# Altium project AIO_3399J_Schematic.PrjPcb (part 3 of 5)

## Sheet HOST_PORT-USB2.0.SchDoc
size C
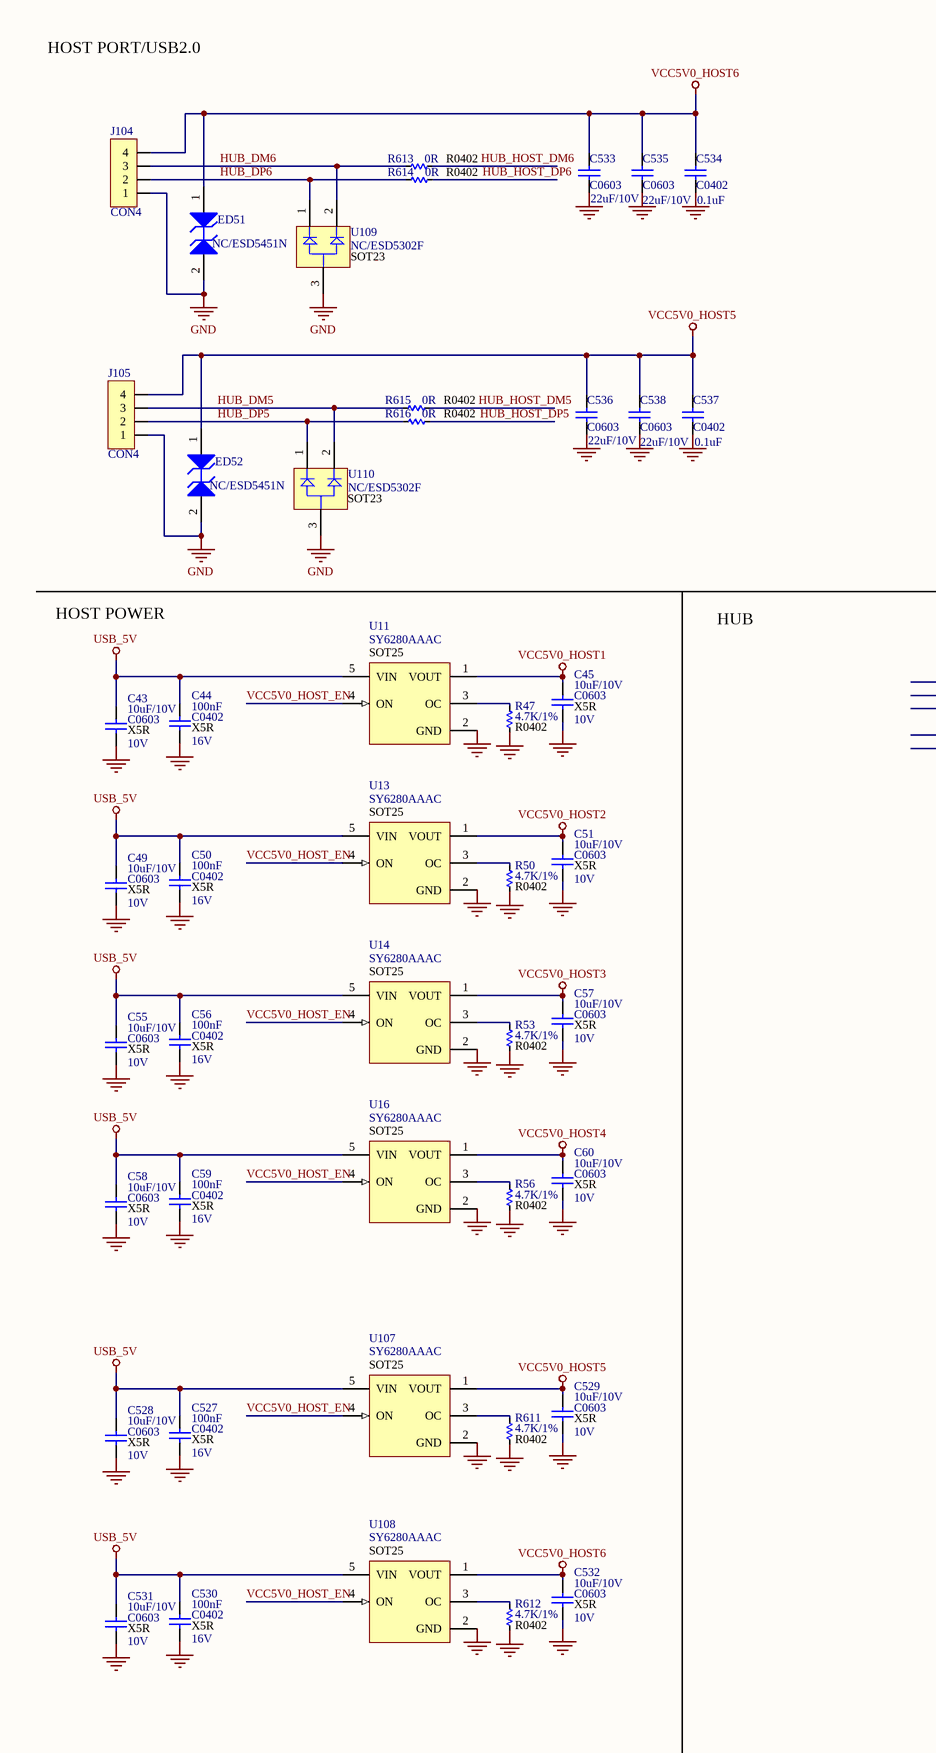
[diagram p9: HOST_PORT-USB2.0.SchDoc, left]
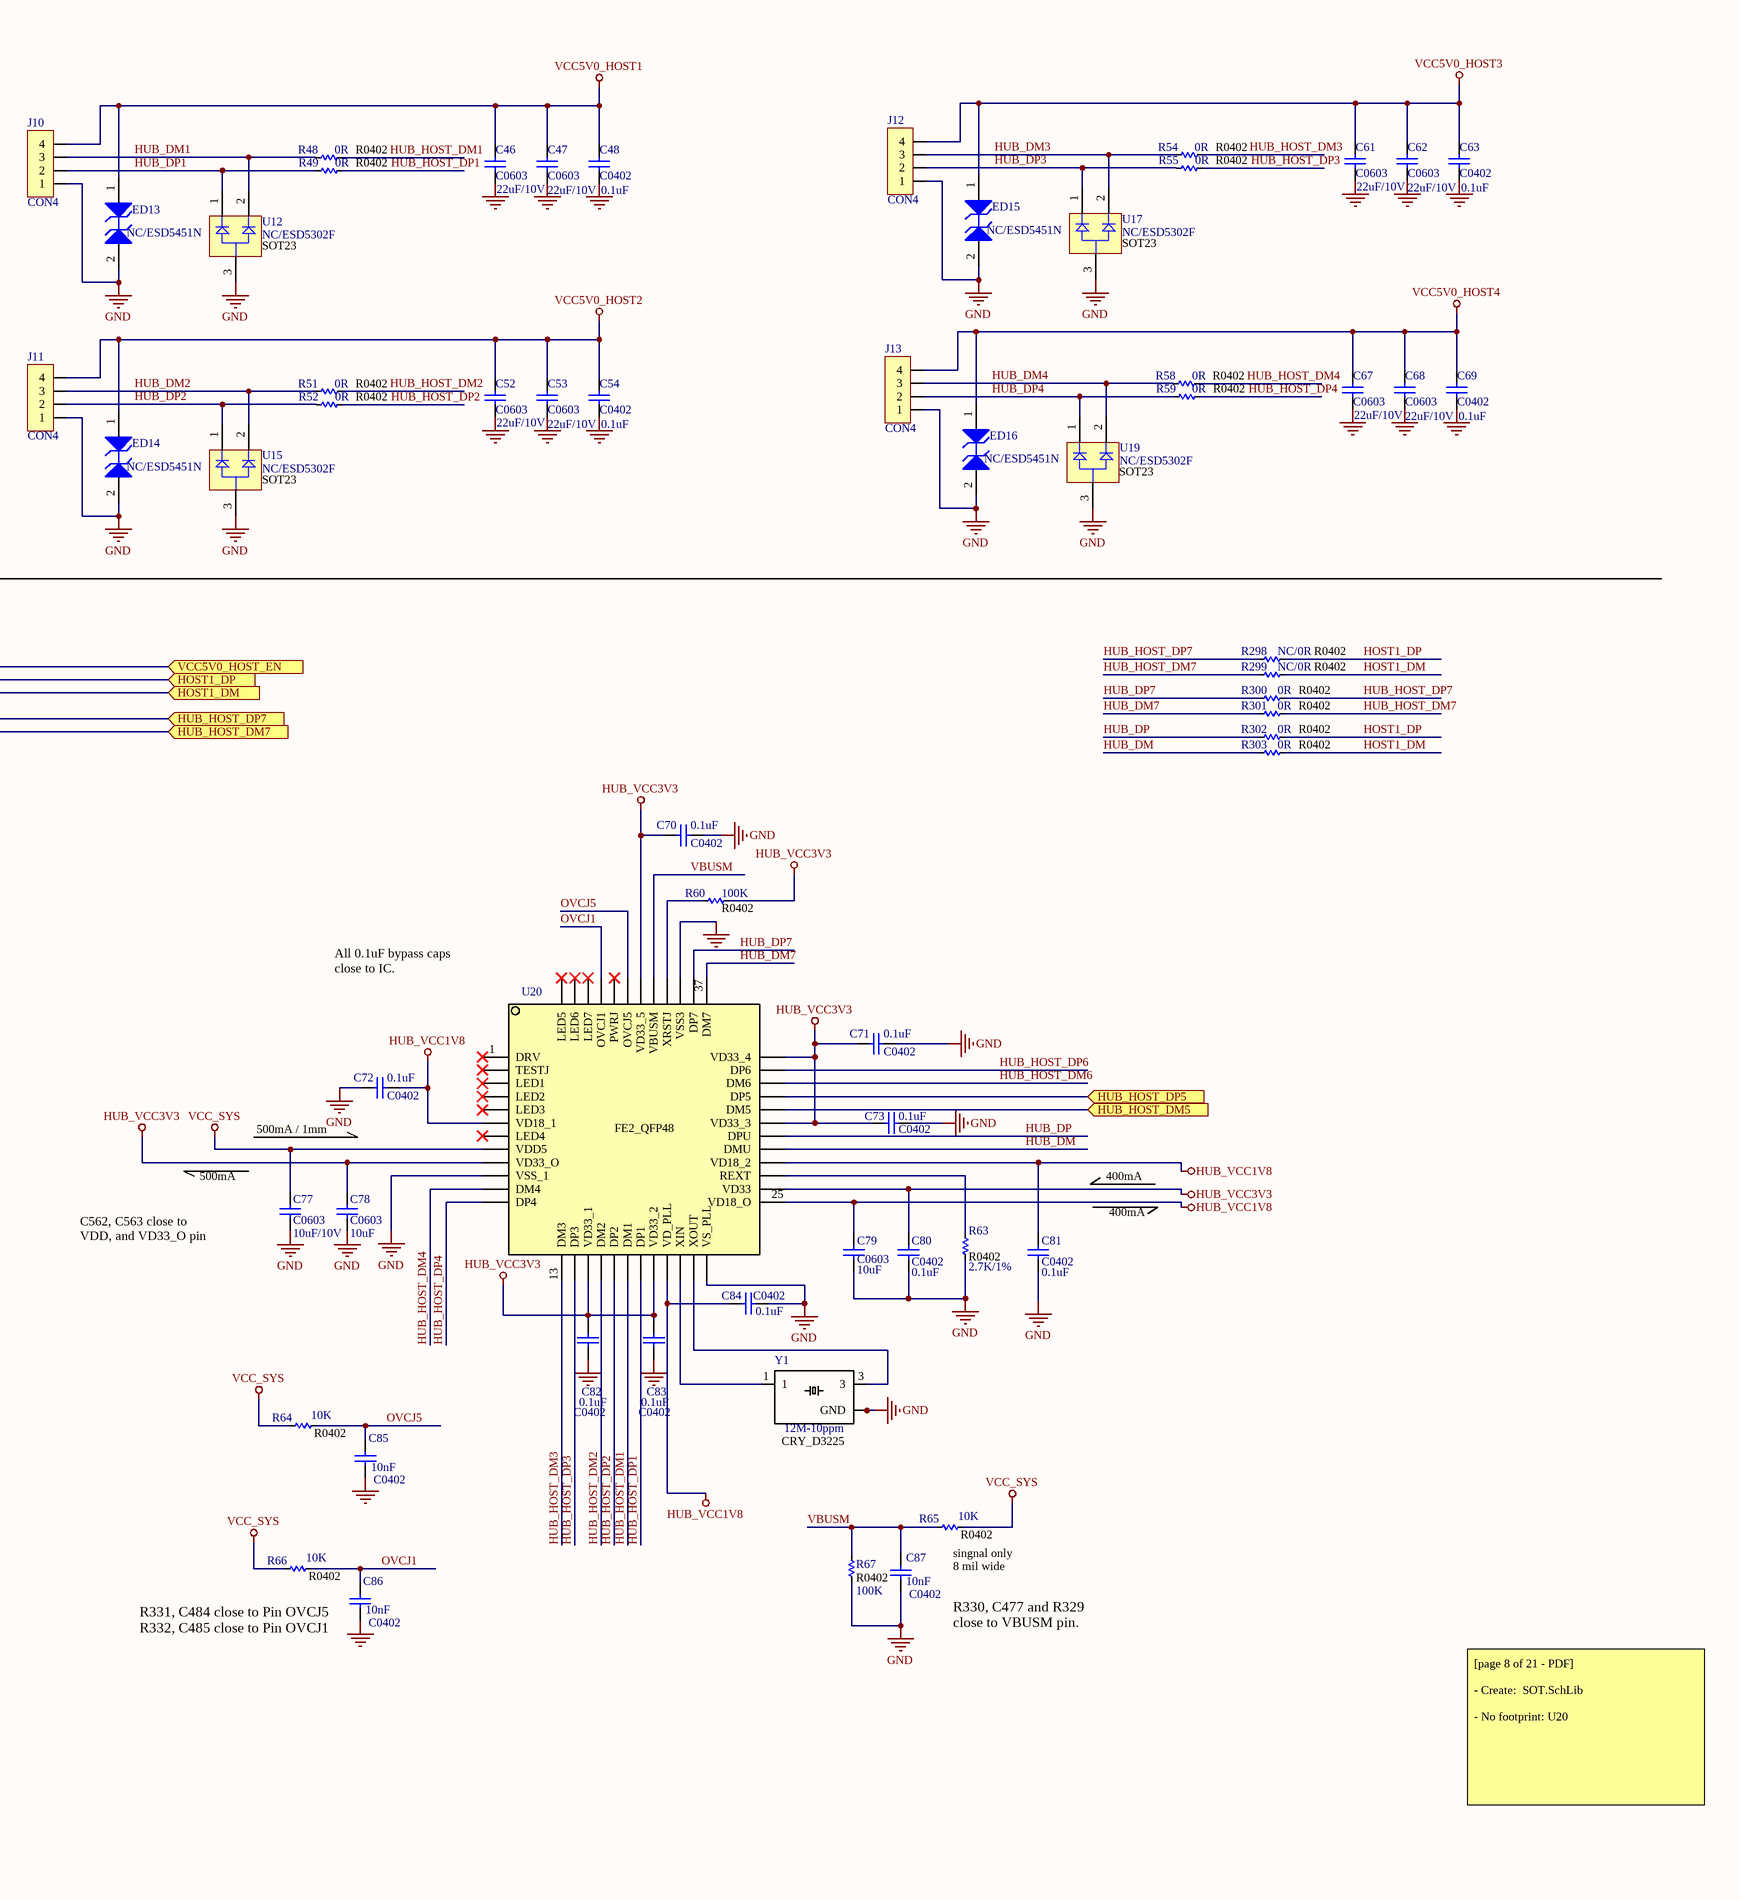
[diagram p10: HOST_PORT-USB2.0.SchDoc, right]

### Parts
C43  C0603  value 10uF/10V  [C 0603]
C44  C0402  value 100nF  [C 0402]
C45  C0603  value 10uF/10V  [C 0603]
C46  C0603  value 22uF/10V  [C 0603]
C47  C0603  value 22uF/10V  [C 0603]
C48  C0402  value 0.1uF  [C 0402]
C49  C0603  value 10uF/10V  [C 0603]
C50  C0402  value 100nF  [C 0402]
C51  C0603  value 10uF/10V  [C 0603]
C52  C0603  value 22uF/10V  [C 0603]
C53  C0603  value 22uF/10V  [C 0603]
C54  C0402  value 0.1uF  [C 0402]
C55  C0603  value 10uF/10V  [C 0603]
C56  C0402  value 100nF  [C 0402]
C57  C0603  value 10uF/10V  [C 0603]
C58  C0603  value 10uF/10V  [C 0603]
C59  C0402  value 100nF  [C 0402]
C60  C0603  value 10uF/10V  [C 0603]
C61  C0603  value 22uF/10V  [C 0603]
C62  C0603  value 22uF/10V  [C 0603]
C63  C0402  value 0.1uF  [C 0402]
C67  C0603  value 22uF/10V  [C 0603]
C68  C0603  value 22uF/10V  [C 0603]
C69  C0402  value 0.1uF  [C 0402]
C70  C0402  value 0.1uF  [C 0402]
C71  C0402  value 0.1uF  [C 0402]
C72  C0402  value 0.1uF  [C 0402]
C73  C0402  value 0.1uF  [C 0402]
C77  C0603  value 10uF/10V  [C 0603]
C78  C0603  value 10uF  [C 0603]
C79  C0603  value 10uF  [C 0603]
C80  C0402  value 0.1uF  [C 0402]
C81  C0402  value 0.1uF  [C 0402]
C82  C0402  value 0.1uF  [C 0402]
C83  C0402  value 0.1uF  [C 0402]
C84  C0402  value 0.1uF  [C 0402]
C85  C0402  value 10nF  [C 0402]
C86  C0402  value 10nF  [C 0402]
C87  C0402  value 10nF  [C 0402]
C527  C0402  value 100nF  [C 0402]
C528  C0603  value 10uF/10V  [C 0603]
C529  C0603  value 10uF/10V  [C 0603]
C530  C0402  value 100nF  [C 0402]
C531  C0603  value 10uF/10V  [C 0603]
C532  C0603  value 10uF/10V  [C 0603]
C533  C0603  value 22uF/10V  [C 0603]
C534  C0402  value 0.1uF  [C 0402]
C535  C0603  value 22uF/10V  [C 0603]
C536  C0603  value 22uF/10V  [C 0603]
C537  C0402  value 0.1uF  [C 0402]
C538  C0603  value 22uF/10V  [C 0603]
ED13  NC/ESD5451N  [DFN1006-2L]
ED14  NC/ESD5451N  [DFN1006-2L]
ED15  NC/ESD5451N  [DFN1006-2L]
ED16  NC/ESD5451N  [DFN1006-2L]
ED51  NC/ESD5451N  [DFN1006-2L]
ED52  NC/ESD5451N  [DFN1006-2L]
J10  CON4  [CON4]
J11  CON4  [CON4]
J12  CON4  [CON4]
J13  CON4  [CON4]
J104  CON4  [CON4]
J105  CON4  [CON4]
R47  R0402  value 4.7K/1%  [R 0402]
R48  R0402  value 0R  [R 0402]
R49  R0402  value 0R  [R 0402]
R50  R0402  value 4.7K/1%  [R 0402]
R51  R0402  value 0R  [R 0402]
R52  R0402  value 0R  [R 0402]
R53  R0402  value 4.7K/1%  [R 0402]
R54  R0402  value 0R  [R 0402]
R55  R0402  value 0R  [R 0402]
R56  R0402  value 4.7K/1%  [R 0402]
R58  R0402  value 0R  [R 0402]
R59  R0402  value 0R  [R 0402]
R60  R0402  value 100K  [R 0402]
R63  R0402  value 2.7K/1%  [R 0402]
R64  R0402  value 10K  [R 0402]
R65  R0402  value 10K  [R 0402]
R66  R0402  value 10K  [R 0402]
R67  R0402  value 100K  [R 0402]
R298  R0402  value NC/0R  [R 0402]
R299  R0402  value NC/0R  [R 0402]
R300  R0402  value 0R  [R 0402]
R301  R0402  value 0R  [R 0402]
R302  R0402  value 0R  [R 0402]
R303  R0402  value 0R  [R 0402]
R611  R0402  value 4.7K/1%  [R 0402]
R612  R0402  value 4.7K/1%  [R 0402]
R613  R0402  value 0R  [R 0402]
R614  R0402  value 0R  [R 0402]
R615  R0402  value 0R  [R 0402]
R616  R0402  value 0R  [R 0402]
U11  SY6280AAAC  [DCK5_N]
U12  NC/ESD5302F  PackageReference: SOT23  [INF-SOT23_N]
U13  SY6280AAAC  [DCK5_N]
U14  SY6280AAAC  [DCK5_N]
U15  NC/ESD5302F  PackageReference: SOT23  [INF-SOT23_N]
U16  SY6280AAAC  [DCK5_N]
U17  NC/ESD5302F  PackageReference: SOT23  [INF-SOT23_N]
U19  NC/ESD5302F  PackageReference: SOT23  [INF-SOT23_N]
U20  FE2_QFP48  [LQFP48_N]  (value not drawn)
U107  SY6280AAAC  [DCK5_N]
U108  SY6280AAAC  [DCK5_N]
U109  NC/ESD5302F  PackageReference: SOT23  [INF-SOT23_N]
U110  NC/ESD5302F  PackageReference: SOT23  [INF-SOT23_N]
Y1  12M-10ppm  [Crystal 4-SMD 32x25]

### Ports
HOST1_DM (in), HOST1_DP (in), HUB_HOST_DM5 (in), HUB_HOST_DM7 (in), HUB_HOST_DP5 (in), HUB_HOST_DP7 (in), VCC5V0_HOST_EN (in)

### Nets
GND: C43.2 C44.2 C45.2 C46.1 C47.1 C48.1 C49.2 C50.2 C51.2 C52.1 C53.1 C54.1 C55.2 C56.2 C57.2 C58.2 C59.2 C60.2 C61.1 C62.1 C63.1 C67.1 C68.1 C69.1 C70.1 C71.1 C72.2 C73.1 C77.2 C78.2 C79.2 C80.2 C81.2 C82.1 C83.2 C84.2 C85.2 C86.2 C87.2 C527.2 C528.2 C529.2 C530.2 C531.2 C532.2 C533.1 C534.1 C535.1 C536.1 C537.1 C538.1 ED13.2(A2) ED14.2(A2) ED15.2(A2) ED16.2(A2) ED51.2(A2) ED52.2(A2) J10.1 J11.1 J12.1 J13.1 J104.1 J105.1 R47.2 R50.2 R53.2 R56.2 R63.2 R67.1 R611.2 R612.2 U11.2(GND) U12.3(A) U13.2(GND) U14.2(GND) U15.3(A) U16.2(GND) U17.3(A) U19.3(A) U20.10(VSS_1) U20.24(VS_PLL) U20.39(VSS3) U107.2(GND) U108.2(GND) U109.3(A) U110.3(A) Y1.2(GND) Y1.4(GND)
HUB_VCC1V8: C72.1 C79.1 C81.1 C84.1 U20.6(VD18_1) U20.21(VD_PLL) U20.25(VD18_O) U20.28(VD18_2)
HUB_VCC3V3: C70.2 C71.2 C73.2 C78.1 C80.1 C82.2 C83.1 R60.1 U20.9(VD33_O) U20.15(VD33_1) U20.20(VD33_2) U20.26(VD33) U20.31(VD33_3) U20.36(VD33_4) U20.42(VD33_5)
USB_5V: C43.1 C44.1 C49.1 C50.1 C55.1 C56.1 C58.1 C59.1 C527.1 C528.1 C530.1 C531.1 U11.5(VIN) U13.5(VIN) U14.5(VIN) U16.5(VIN) U107.5(VIN) U108.5(VIN)
VCC5V0_HOST1: C45.1 C46.2 C47.2 C48.2 ED13.1(A1) J10.4 U11.1(VOUT)
VCC5V0_HOST2: C51.1 C52.2 C53.2 C54.2 ED14.1(A1) J11.4 U13.1(VOUT)
VCC5V0_HOST3: C57.1 C61.2 C62.2 C63.2 ED15.1(A1) J12.4 U14.1(VOUT)
VCC5V0_HOST4: C60.1 C67.2 C68.2 C69.2 ED16.1(A1) J13.4 U16.1(VOUT)
VCC5V0_HOST5: C529.1 C536.2 C537.2 C538.2 ED52.1(A1) J105.4 U107.1(VOUT)
VCC5V0_HOST6: C532.1 C533.2 C534.2 C535.2 ED51.1(A1) J104.4 U108.1(VOUT)
VCC_SYS: C77.1 R64.1 R65.2 R66.1 U20.8(VDD5)
HOST1_DM: R299.1 R303.1
HOST1_DP: R298.1 R302.1
HUB_DM: R303.2 U20.29(DMU)
HUB_DM1: J10.3 R48.2 U12.2(K2)
HUB_DM2: J11.3 R51.2 U15.2(K2)
HUB_DM3: J12.3 R54.2 U17.2(K2)
HUB_DM4: J13.3 R58.2 U19.2(K2)
HUB_DM5: J105.3 R615.2 U110.2(K2)
HUB_DM6: J104.3 R613.2 U109.2(K2)
HUB_DM7: R301.2 U20.37(DM7)
HUB_DP: R302.2 U20.30(DPU)
HUB_DP1: J10.2 R49.2 U12.1(K1)
HUB_DP2: J11.2 R52.2 U15.1(K1)
HUB_DP3: J12.2 R55.2 U17.1(K1)
HUB_DP4: J13.2 R59.2 U19.1(K1)
HUB_DP5: J105.2 R616.2 U110.1(K1)
HUB_DP6: J104.2 R614.2 U109.1(K1)
HUB_DP7: R300.2 U20.38(DP7)
HUB_HOST_DM1: R48.1 U20.18(DM1)
HUB_HOST_DM2: R51.1 U20.16(DM2)
HUB_HOST_DM3: R54.1 U20.13(DM3)
HUB_HOST_DM4: R58.1 U20.11(DM4)
HUB_HOST_DM5: R615.1
HUB_HOST_DM6: R613.1 U20.34(DM6)
HUB_HOST_DM7: R299.2 R301.1
HUB_HOST_DP1: R49.1 U20.19(DP1)
HUB_HOST_DP2: R52.1 U20.17(DP2)
HUB_HOST_DP3: R55.1 U20.14(DP3)
HUB_HOST_DP4: R59.1 U20.12(DP4)
HUB_HOST_DP5: R616.1
HUB_HOST_DP6: R614.1 U20.35(DP6)
HUB_HOST_DP7: R298.2 R300.1
OVCJ1: C86.1 R66.2 U20.45(OVCJ1)
OVCJ5: C85.1 R64.2 U20.43(OVCJ5)
VBUSM: C87.1 R65.1 R67.2 U20.41(VBUSM)
VCC5V0_HOST_EN: U11.4(ON) U13.4(ON) U14.4(ON) U16.4(ON) U107.4(ON) U108.4(ON)
NetR47_1: R47.1 U11.3(OC)
NetR50_1: R50.1 U13.3(OC)
NetR53_1: R53.1 U14.3(OC)
NetR56_1: R56.1 U16.3(OC)
NetR60_2: R60.2 U20.40(XRSTJ)
NetR63_1: R63.1 U20.27(REXT)
NetR611_1: R611.1 U107.3(OC)
NetR612_1: R612.1 U108.3(OC)
NetU20_22: U20.22(XIN) Y1.1
NetU20_23: U20.23(XOUT) Y1.3
NetU20_32: U20.32(DM5) ; port HUB_HOST_DM5
NetU20_33: U20.33(DP5) ; port HUB_HOST_DP5

Not connected (* = marked no-connect by the designer): U20 1(DRV)* 2(TESTJ)* 3(LED1)* 4(LED2)* 5(LED3)* 7(LED4)* 44(PWRJ)* 46(LED7)* 47(LED6)* 48(LED5)*

### Notes on the sheet
- HOST PORT/USB2.0
- HOST POWER
- HUB
- All 0.1uF bypass caps close to IC.
- 500mA
- 500mA / 1mm
- 400mA
- C562, C563 close to VDD, and VD33_O pin
- (near R65) singnal only 8 mil wide
- R331, C484 close to Pin OVCJ5
  R332, C485 close to Pin OVCJ1
- R330, C477 and R329 close to VBUSM pin.
- [page 8 of 21 - PDF]
  - Create:  SOT.SchLib
  - No footprint: U20
- (in symbol ABM8-30.000MHZ-10-1-U-T) CRY_D3225
- (in symbol Cap) X5R; 16V; 10V
- (in symbol TPS22943DCKR) SOT25

### Library data of the parts
C43-C63 C67-C73 C77-C87 C527-C538 = Cap: Capacitor; Published: 8-Jun-2000; LatestRevisionDate: 17-Jul-2002; LatestRevisionNote: Re-released for DXP Platform.; PackageReference: RAD-0.3; Publisher: Altium Limited; PackageDescription: Radial Cap, Thru-Hole; 2 Leads; 0.3 in Pin Spacing
ED13-ED16 ED51 ED52 = 1SMB54CAT3: 600 W Peak Power Zener Transient Voltage Suppressor, Bidirectional, 2-Pin SMB, Tape and Reel; Manufacturer: On Semiconductor; IR Max (uA): 5; PPK Max (W): 600; V(BR) Typ (V): 63.16; DatasheetVersion: Rev. A; PackageVersion: Rev. A, 01/2000; PackageReference: SMB-2-403C-01; PackageDescription: 2-Pin Small Molded Package, J-Bend Lead, Body 4.315 x 3.555 mm; Supplier 1: Digi-Key; Supplier Part Number 1: 1SMB54CAT3-ND; Direction: Bidirectional; Packing: Tape and Reel; Mounting Technology: Surface Mount; PartNumber: 1SMB54CAT3; ComponentLink1Description: Manufacturer URL; ComponentLink1URL: http://www.onsemi.com/; ComponentLink2Description: Datasheet; ComponentLink2URL: http://www.onsemi.com/pub_link/Collateral/1SMB10CAT3-D.PDF; ComponentLink3Description: Package Specification; ComponentLink3URL: http://www.onsemi.com/pub_link/Collateral/1SMB10CAT3-D.PDF
J10-J13 J104 J105 = JP4: WR-PHD 2.54 mm Angled Socket Header; Manufacturer: W¨¹rth Elektronik eiSos GmbH; partNo: 613004143121; ComponentLink1 Description: Manufacturer; ComponentLink2 Description: Datasheet; NoPins: 04; Created Date: 29 March 2013; ComponentLink1URL: http://www.we-online.com; ComponentLink2URL: http://katalog.we-online.de/em/datasheet/6130xx143121.pdf; Created by: Karrer Zheng
R47-R56 R58-R60 R63-R67 R298-R303 R611-R616 = Res-SMD: Resistor; Manufacturer: Generic Components; Class: Passive; Published: 08/06/2000; Publisher: Altium Hobart Technology Centre
U11 U13 U14 U16 U107 U108 = TPS22943DCKR: Low-Input Voltage 40 mA Current Limited Load Switch, 400 mOhms rDS(On), -40 to 85 degC, 5-pin SC70 (DCK), Green (RoHS & no Sb/Br); Manufacturer: Texas Instruments; Adjustable Current Limit(Min)(A): 0.04; Enable/Shutdown: Active High; Iq(Typ)(uA): 40; Number of FETs: 1; rDS(on) per FET(Typ)(mOhms): 400; SubFamily: Current Limited Switch; Vin(Max)(V): 5.5; Vin(Min)(V): 1.62; DatasheetVersion: SLVS832C; PackageVersion: revG, Jan-2007; PackageReference: DCK5; PackageDescription: 5-Pin Plastic Small-Outline Package, 2 x 1.3 mm Body, 0.65 mm Pitch, 2.1 mm Lead Span; Supplier 1: Digi-Key; Supplier Part Number 1: 296-25316-2-ND; Supplier 2: Digi-Key; Supplier Part Number 2: 296-25316-1-ND; Supplier 3: Digi-Key; Supplier Part Number 3: 296-25316-6-ND; Supplier 4: Farnell; Supplier Part Number 4: 1782839; Supplier 5: Newark; Supplier Part Number 5: 51R1165; Supplier 6: Mouser; Supplier Part Number 6: 595-TPS22943DCKR; Eco-Plan: Green (RoHS & no Sb/Br); Mounting Technology: Surface Mount; Code_JEDEC: MO-203-AA; PartNumber: TPS22943DCKR; ComponentLink1Description: Datasheet; ComponentLink1URL: http://www.ti.com/general/docs/lit/getliterature.tsp?genericPartNumber=TPS22943&fileType=pdf
U12 U15 U17 U19 U109 U110 = BAT64-06: Silicon Schottky Diode, SOT23, Reel, Green; Manufacturer: Infineon; Configuration: Dual; CT (max): 6 pF; Green: TRUE; IF (max): 250 mA; VF (max): 750 mV; VR (max): 40 V; PackageVersion: Apr-08; PackageDescription: 3-Pin Small Outline Transistor Package, 1.3 x 2.9 mm Body, 0.95 mm Pitch; Supplier 1: Mouser; Supplier Part Number 1: N/A; Packing: Reel; Mounting Technology: Surface Mount; PartNumber: BAT64-06; ComponentLink1Description: Manufacturer URL; ComponentLink1URL: http://www.infineon.com/; ComponentLink2Description: Datasheet; ComponentLink2URL: http://www.infineon.com/dgdl/bat64series.pdf?folderId=db3a30431400ef68011425f1ca2505e3&fileId=db3a304314dca3890115191757980ead; ComponentLink3Description: Package Specification; ComponentLink3URL: http://www.infineon.com/dgdl/SOT23-Package_Overview.pdf?folderId=db3a30431936bc4b0119532290053c66&fileId=db3a30431936bc4b0119533468123c85
Y1 = ABM8-30.000MHZ-10-1-U-T: Ultra Miniature Crystal, SMD Ceramic, 30.000MHZ, 10pF, 10ppm@25C, 10ppm -10+60C,; MF: Abracon; SnapEDA_Link: https://www.snapeda.com/parts/ABM8-30.000MHZ-10-1-U-T/Abracon%20LLC/view-part/?ref=snap; MP: ABM8-30.000MHZ-10-1-U-T; Availability: Unavailable; Price: None; Package: SMD-4 Abracon; Value: *

## Sheet TYPE_CO-USB3.0.SchDoc
size B
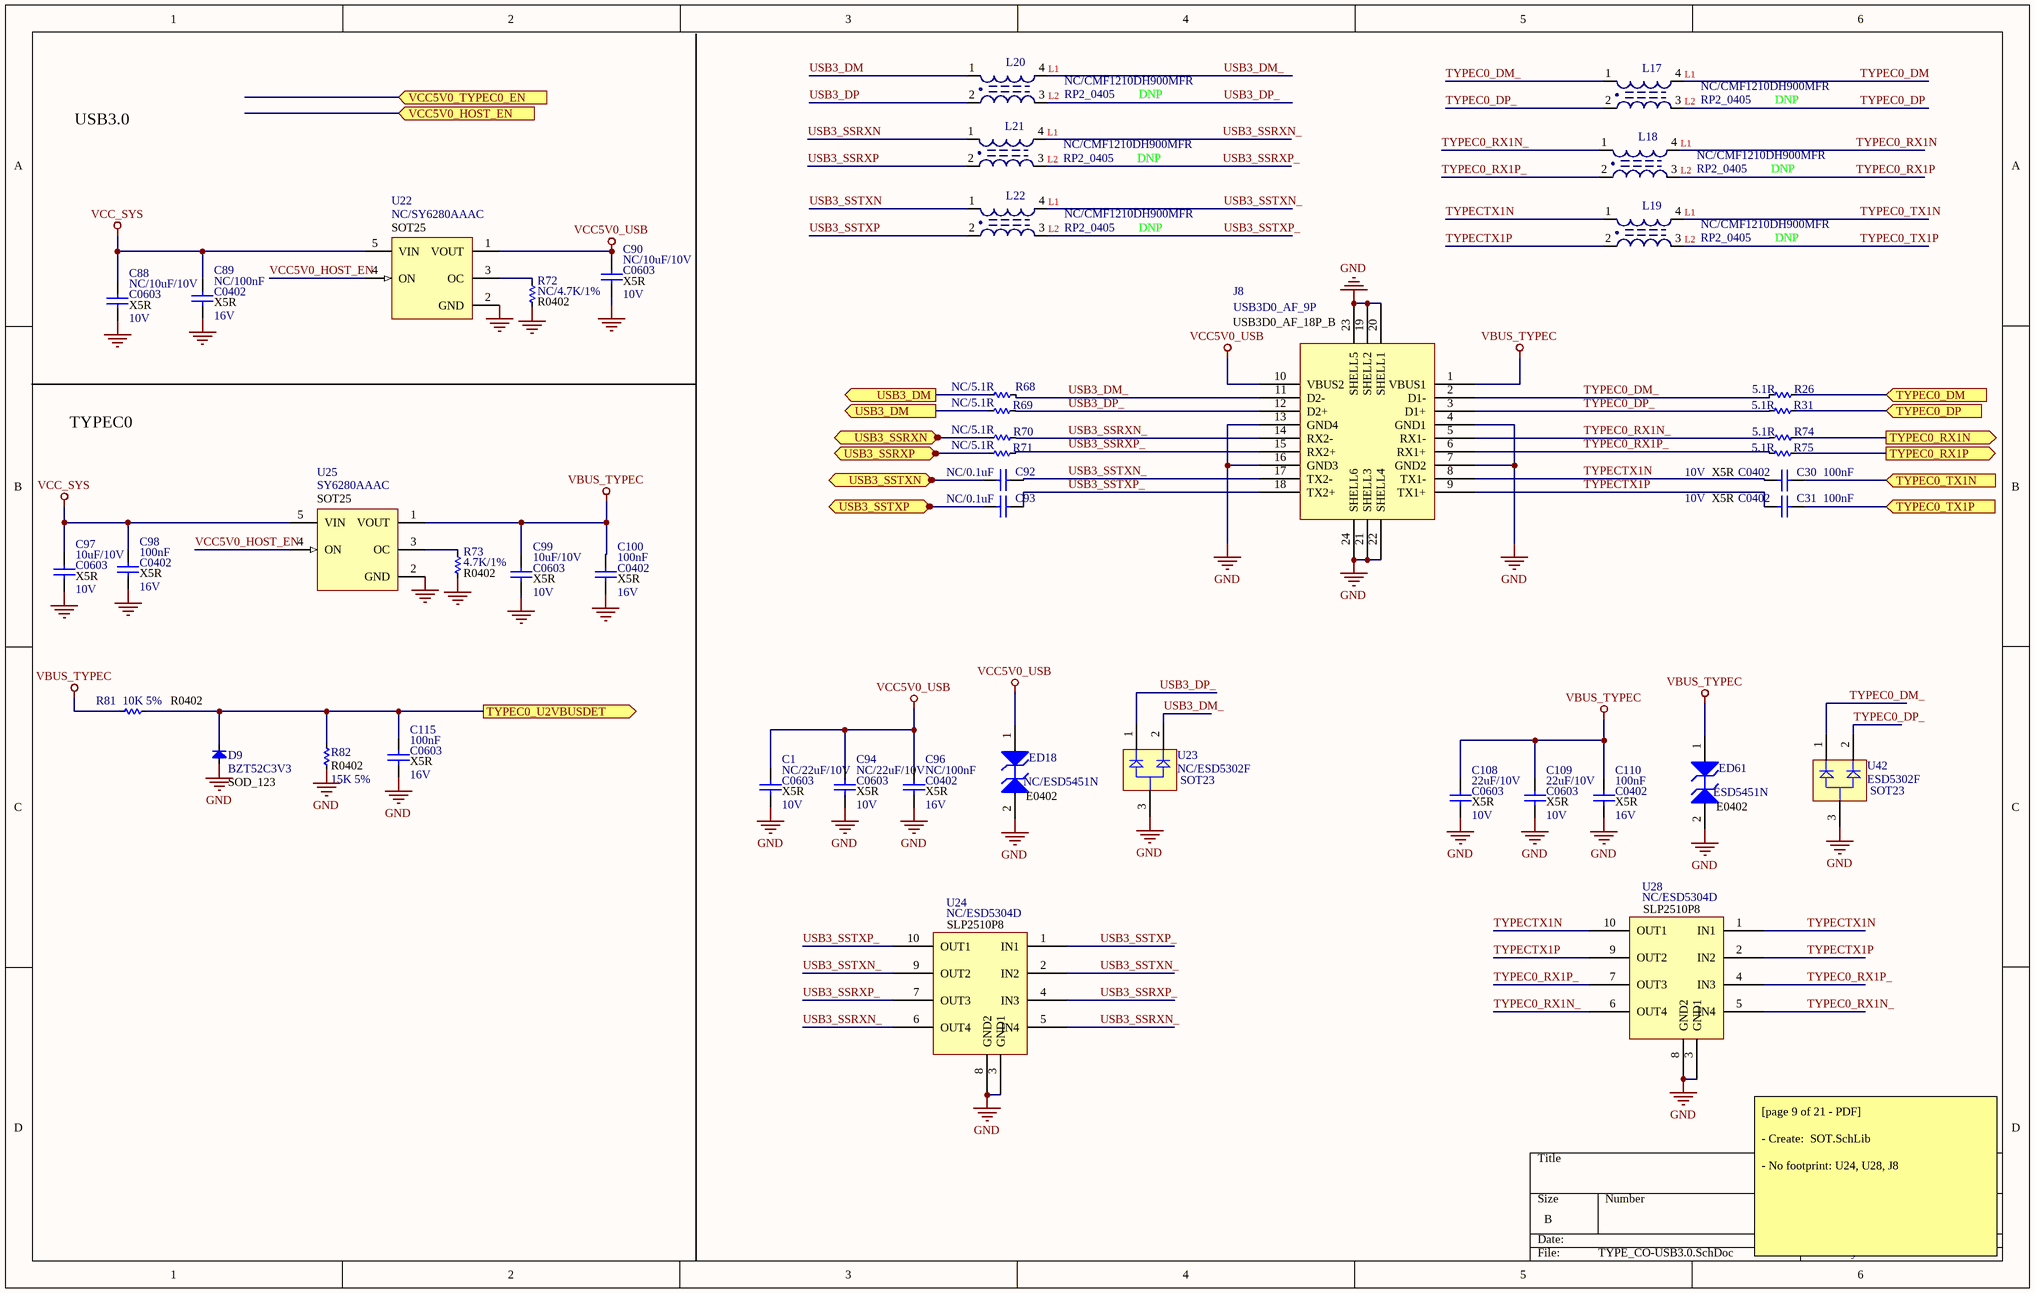
[diagram p11: TYPE_CO-USB3.0.SchDoc]

### Parts
C1  C0603  value NC/22uF/10V  [C 0603]
C30  C0402  value 100nF  [C 0402]
C31  C0402  value 100nF  [C 0402]
C88  C0603  value NC/10uF/10V  [C 0603]
C89  C0402  value NC/100nF  [C 0402]
C90  C0603  value NC/10uF/10V  [C 0603]
C92  value NC/0.1uF  [C 0402]  (hidden comment: C0402)
C93  value NC/0.1uF  [C 0402]  (hidden comment: C0402)
C94  C0603  value NC/22uF/10V  [C 0603]
C96  C0402  value NC/100nF  [C 0402]
C97  C0603  value 10uF/10V  [C 0603]
C98  C0402  value 100nF  [C 0402]
C99  C0603  value 10uF/10V  [C 0603]
C100  C0402  value 100nF  [C 0402]
C108  C0603  value 22uF/10V  [C 0603]
C109  C0603  value 22uF/10V  [C 0603]
C110  C0402  value 100nF  [C 0402]
C115  C0603  value 100nF  [C 0603]
D9  value BZT52C3V3  typr: SOD_123  [DIO-SMD-123]  (hidden comment: Diode SMD)
ED18  NC/ESD5451N  [DFN1006-2L]
ED61  ESD5451N  [DFN1006-2L]
J8  USB3D0_AF_9P  [*GCT_USB1100-XX-X_REVC]
L17  RP2_0405  [L-SMD-D-7.3x7.3]
L18  RP2_0405  [L-SMD-D-7.3x7.3]
L19  RP2_0405  [L-SMD-D-7.3x7.3]
L20  RP2_0405  [L-SMD-D-7.3x7.3]
L21  RP2_0405  [L-SMD-D-7.3x7.3]
L22  RP2_0405  [L-SMD-D-7.3x7.3]
R26  value 5.1R  [R 0402]  (hidden comment: R0402)
R31  value 5.1R  [R 0402]  (hidden comment: R0402)
R68  value NC/5.1R  [R 0402]  (hidden comment: R0402)
R69  value NC/5.1R  [R 0402]  (hidden comment: R0402)
R70  value NC/5.1R  [R 0402]  (hidden comment: R0402)
R71  value NC/5.1R  [R 0402]  (hidden comment: R0402)
R72  R0402  value NC/4.7K/1%  [R 0402]
R73  R0402  value 4.7K/1%  [R 0402]
R74  value 5.1R  [R 0402]  (hidden comment: R0402)
R75  value 5.1R  [R 0402]  (hidden comment: R0402)
R81  R0402  value 10K 5%  [R 0402]
R82  R0402  value 15K 5%  [R 0402]
U22  NC/SY6280AAAC  [DCK5_N]
U23  NC/ESD5302F  PackageReference: SOT23  [INF-SOT23_N]
U24  NC/ESD5304D  [RCLAMP0524PATCT]
U25  SY6280AAAC  [DCK5_N]
U28  NC/ESD5304D  [RCLAMP0524PATCT]
U42  ESD5302F  PackageReference: SOT23  [INF-SOT23_N]

### Ports
TYPEC0_DM (in), TYPEC0_DP (in), TYPEC0_RX1N (out), TYPEC0_RX1P (out), TYPEC0_TX1N (in), TYPEC0_TX1P (in), TYPEC0_U2VBUSDET (out), USB3_DM (out), USB3_SSRXN (out), USB3_SSRXP (out), USB3_SSTXN (out), USB3_SSTXP (out), VCC5V0_HOST_EN (in), VCC5V0_TYPEC0_EN (in)

### Nets
GND: C1.2 C88.2 C89.2 C90.2 C94.2 C96.2 C97.2 C98.2 C99.2 C100.2 C108.2 C109.2 C110.2 C115.2 D9.1(A) ED18.2(A2) ED61.2(A2) J8.4(GND1) J8.7(GND2) J8.13(GND4) J8.16(GND3) J8.19(SHELL2) J8.20(SHELL1) J8.21(SHELL3) J8.22(SHELL4) J8.23(SHELL5) J8.24(SHELL6) R72.2 R73.2 R82.1 U22.2(GND) U23.3(A) U24.3(GND1) U24.8(GND2) U25.2(GND) U28.3(GND1) U28.8(GND2) U42.3(A)
VBUS_TYPEC: C99.1 C100.1 C108.1 C109.1 C110.1 ED61.1(A1) J8.1(VBUS1) R81.1 U25.1(VOUT)
VCC5V0_USB: C1.1 C90.1 C94.1 C96.1 ED18.1(A1) J8.10(VBUS2) U22.1(VOUT)
VCC_SYS: C88.1 C89.1 C97.1 C98.1 U22.5(VIN) U25.5(VIN)
TYPEC0_DM: R26.1 ; port TYPEC0_DM
TYPEC0_DM: L17.4  [a separate net that carries the same name]
TYPEC0_DM_: J8.2(D1-) L17.1 R26.2 U42.1(K1)
TYPEC0_DP: R31.1 ; port TYPEC0_DP
TYPEC0_DP: L17.3  [a separate net that carries the same name]
TYPEC0_DP_: J8.3(D1+) L17.2 R31.2 U42.2(K2)
TYPEC0_RX1N: R74.1 ; port TYPEC0_RX1N
TYPEC0_RX1N: L18.4  [a separate net that carries the same name]
TYPEC0_RX1N_: J8.5(RX1-) L18.1 R74.2 U28.5(IN4) U28.6(OUT4)
TYPEC0_RX1P: R75.1 ; port TYPEC0_RX1P
TYPEC0_RX1P: L18.3  [a separate net that carries the same name]
TYPEC0_RX1P_: J8.6(RX1+) L18.2 R75.2 U28.4(IN3) U28.7(OUT3)
TYPEC0_TX1N: C30.2 ; port TYPEC0_TX1N
TYPEC0_TX1N: L19.4  [a separate net that carries the same name]
TYPEC0_TX1P: C31.2 ; port TYPEC0_TX1P
TYPEC0_TX1P: L19.3  [a separate net that carries the same name]
TYPEC0_U2VBUSDET: C115.1 D9.2(K) R81.2 R82.2 ; port TYPEC0_U2VBUSDET
TYPECTX1N: C30.1 J8.8(TX1-) L19.1 U28.1(IN1) U28.10(OUT1)
TYPECTX1P: C31.1 J8.9(TX1+) L19.2 U28.2(IN2) U28.9(OUT2)
USB3_DM: R68.2 R69.2 ; port USB3_DM
USB3_DM: L20.1  [a separate net that carries the same name]
USB3_DM_: J8.11(D2-) L20.4 R68.1 U23.2(K2)
USB3_DP: L20.2
USB3_DP_: J8.12(D2+) L20.3 R69.1 U23.1(K1)
USB3_SSRXN: R70.2 ; port USB3_SSRXN
USB3_SSRXN: L21.1  [a separate net that carries the same name]
USB3_SSRXN_: J8.14(RX2-) L21.4 R70.1 U24.5(IN4) U24.6(OUT4)
USB3_SSRXP: R71.2 ; port USB3_SSRXP
USB3_SSRXP: L21.2  [a separate net that carries the same name]
USB3_SSRXP_: J8.15(RX2+) L21.3 R71.1 U24.4(IN3) U24.7(OUT3)
USB3_SSTXN: C92.1 ; port USB3_SSTXN
USB3_SSTXN: L22.1  [a separate net that carries the same name]
USB3_SSTXN_: C92.2 J8.17(TX2-) L22.4 U24.2(IN2) U24.9(OUT2)
USB3_SSTXP: C93.1 ; port USB3_SSTXP
USB3_SSTXP: L22.2  [a separate net that carries the same name]
USB3_SSTXP_: C93.2 J8.18(TX2+) L22.3 U24.1(IN1) U24.10(OUT1)
VCC5V0_HOST_EN: U22.4(ON) U25.4(ON)
NetR72_1: R72.1 U22.3(OC)
NetR73_1: R73.1 U25.3(OC)

### Notes on the sheet
- USB3.0
- TYPEC0
- [page 9 of 21 - PDF]
  - Create:  SOT.SchLib
  - No footprint: U24, U28, J8
- (in symbol 1SMB54CAT3) E0402
- (in symbol Cap) X5R; 16V; 10V
- (in symbol L-SMD-2) L1; NC/CMF1210DH900MFR; L2; DNP
- (in symbol TPS22943DCKR) SOT25

### Library data of the parts
C1 C30 C31 C88-C90 C92-C94 C96-C100 C108-C110 C115 = Cap: Capacitor; Published: 8-Jun-2000; LatestRevisionDate: 17-Jul-2002; LatestRevisionNote: Re-released for DXP Platform.; PackageReference: RAD-0.3; Publisher: Altium Limited; PackageDescription: Radial Cap, Thru-Hole; 2 Leads; 0.3 in Pin Spacing
D9 = Diode SMD: Default Diode; Code - JEDEC: DO-214-AB; Published: 8-Jun-2000; Revision: July-2002: Re-released for DXP Platform.; Publisher: Altium Limited
ED18 ED61 = 1SMB54CAT3: as ED13-ED16 on sheet HOST_PORT-USB2.0; DatasheetVersion: Rev. A; PackageVersion: Rev. A, 01/2000; PackageReference: SMB-2-403C-01; PackageDescription: 2-Pin Small Molded Package, J-Bend Lead, Body 4.315 x 3.555 mm; Supplier 1: Digi-Key; Supplier Part Number 1: 1SMB54CAT3-ND; Direction: Bidirectional; Packing: Tape and Reel; Mounting Technology: Surface Mount; PartNumber: 1SMB54CAT3; ComponentLink1Description: Manufacturer URL; ComponentLink1URL: http://www.onsemi.com/; ComponentLink2Description: Datasheet; ComponentLink2URL: http://www.onsemi.com/pub_link/Collateral/1SMB10CAT3-D.PDF; ComponentLink3Description: Package Specification; ComponentLink3URL: http://www.onsemi.com/pub_link/Collateral/1SMB10CAT3-D.PDF
J8 = USB3D0_AF_18P_B
L17-L22 = L-SMD-2: partNo: 7448709022; Manufacturer: Würth Elektronik eiSos GmbH; Inductance: 2.20 µH; ComponentLink1Description: Manufacturer; ComponentLink1URL: http://www.we-online.de; Created by: Christin Otto; Created Date: August 2013; ComponentLink2Description: Datasheet; ComponentLink2URL: http://katalog.we-online.de/pbs/datasheet/7448709022.pdf
R26 R31 R68-R75 R81 R82 = Res-SMD: as R47-R56 on sheet HOST_PORT-USB2.0; Published: 08/06/2000; Publisher: Altium Hobart Technology Centre
U22 U25 = TPS22943DCKR: as U11 on sheet HOST_PORT-USB2.0; DatasheetVersion: SLVS832C; PackageVersion: revG, Jan-2007; PackageReference: DCK5; PackageDescription: 5-Pin Plastic Small-Outline Package, 2 x 1.3 mm Body, 0.65 mm Pitch, 2.1 mm Lead Span; Supplier 1: Digi-Key; Supplier Part Number 1: 296-25316-2-ND; Supplier 2: Digi-Key; Supplier Part Number 2: 296-25316-1-ND; Supplier 3: Digi-Key; Supplier Part Number 3: 296-25316-6-ND; Supplier 4: Farnell; Supplier Part Number 4: 1782839; Supplier 5: Newark; Supplier Part Number 5: 51R1165; Supplier 6: Mouser; Supplier Part Number 6: 595-TPS22943DCKR; Eco-Plan: Green (RoHS & no Sb/Br); Mounting Technology: Surface Mount; Code_JEDEC: MO-203-AA; PartNumber: TPS22943DCKR; ComponentLink1Description: Datasheet; ComponentLink1URL: http://www.ti.com/general/docs/lit/getliterature.tsp?genericPartNumber=TPS22943&fileType=pdf
U23 U42 = BAS70-06: Silicon Schottky Diode, -55 to 125 degC, SOT23, Reel, Green; Manufacturer: Infineon; Configuration: Dual; CT (max): 2 pF; Green: TRUE; IF (max): 70 mA; VF (max): 1,000 mV; VR (max): 70 V; PackageVersion: Apr-08; PackageDescription: 3-Pin Small Outline Transistor Package, 1.3 x 2.9 mm Body, 0.95 mm Pitch; Packing: Reel; Mounting Technology: Surface Mount; PartNumber: BAS70-06; ComponentLink1Description: Manufacturer URL; ComponentLink1URL: http://www.infineon.com/; ComponentLink2Description: Datasheet; ComponentLink2URL: http://www.infineon.com/dgdl/bas70_bas170series.pdf?folderId=db3a30431400ef68011425f1ca2505e3&fileId=db3a304314dca389011518ad41680e12; ComponentLink3Description: Package Specification; ComponentLink3URL: http://www.infineon.com/dgdl/SOT23-Package_Overview.pdf?folderId=db3a30431936bc4b0119532290053c66&fileId=db3a30431936bc4b0119533468123c85
U24 U28 = SLP2510P8

## Sheet HDMI_OUT.SchDoc
size B
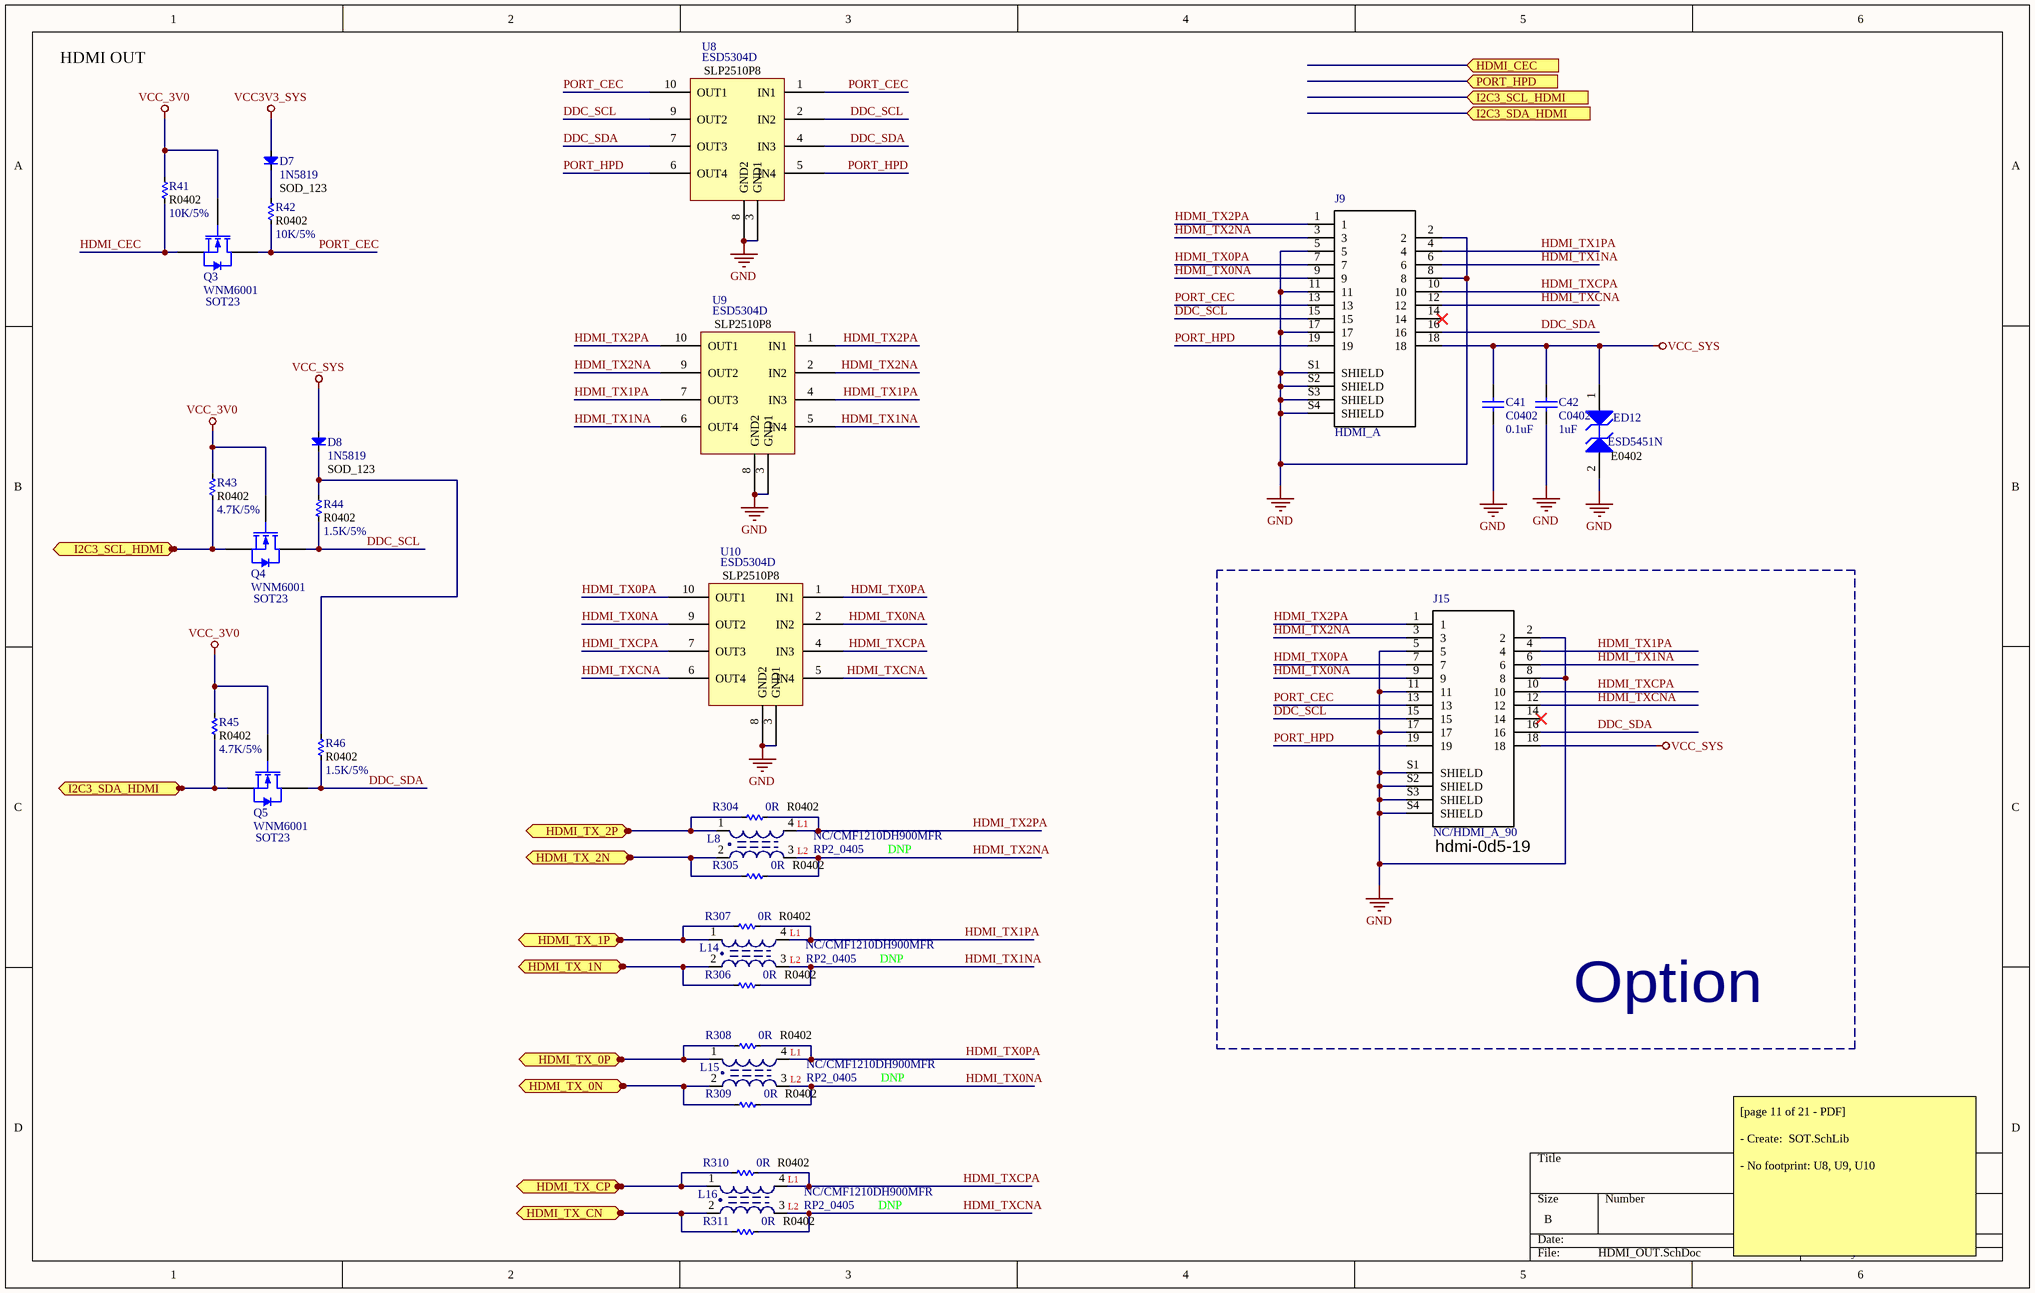
[diagram p12: HDMI_OUT.SchDoc]

### Parts
C41  C0402  value 0.1uF  [C 0402]
C42  C0402  value 1uF  [C 0402]
D7  value 1N5819  typr: SOD_123  [DIO-SMD-123]  (hidden comment: Diode SMD)
D8  value 1N5819  typr: SOD_123  [DIO-SMD-123]  (hidden comment: Diode SMD)
ED12  ESD5451N  [DFN1006-2L]
J9  HDMI_A  [*AMPHENOL_10029449-001RLF_10029449-001RLF(Primary)]
J15  NC/HDMI_A_90  Package: hdmi-0d5-19  [*AMPHENOL_10029449-001RLF_10029449-001RLF(Primary)]
L8  RP2_0405  [L-SMD-D-7.3x7.3]
L14  RP2_0405  [L-SMD-D-7.3x7.3]
L15  RP2_0405  [L-SMD-D-7.3x7.3]
L16  RP2_0405  [L-SMD-D-7.3x7.3]
Q3  WNM6001  [SOT23]
Q4  WNM6001  [SOT23]
Q5  WNM6001  [SOT23]
R41  R0402  value 10K/5%  [R 0402]
R42  R0402  value 10K/5%  [R 0402]
R43  R0402  value 4.7K/5%  [R 0402]
R44  R0402  value 1.5K/5%  [R 0402]
R45  R0402  value 4.7K/5%  [R 0402]
R46  R0402  value 1.5K/5%  [R 0402]
R304  R0402  value 0R  [R 0402]
R305  R0402  value 0R  [R 0402]
R306  R0402  value 0R  [R 0402]
R307  R0402  value 0R  [R 0402]
R308  R0402  value 0R  [R 0402]
R309  R0402  value 0R  [R 0402]
R310  R0402  value 0R  [R 0402]
R311  R0402  value 0R  [R 0402]
U8  ESD5304D  [RCLAMP0524PATCT]
U9  ESD5304D  [RCLAMP0524PATCT]
U10  ESD5304D  [RCLAMP0524PATCT]

### Blocks framed on the sheet
Option: J15

### Ports
HDMI_CEC (in), HDMI_TX_0N (in), HDMI_TX_0P (in), HDMI_TX_1N (in), HDMI_TX_1P (in), HDMI_TX_2N (in), HDMI_TX_2P (in), HDMI_TX_CN (in), HDMI_TX_CP (in), I2C3_SCL_HDMI (in), I2C3_SCL_HDMI (out), I2C3_SDA_HDMI (in), I2C3_SDA_HDMI (out), PORT_HPD (in)

### Nets
GND: C41.2 C42.2 ED12.2(A2) J9.2 J9.5 J9.8 J9.11 J9.17 J9.S1(SHIELD) J9.S2(SHIELD) J9.S3(SHIELD) J9.S4(SHIELD) J15.2 J15.5 J15.8 J15.11 J15.17 J15.S1(SHIELD) J15.S2(SHIELD) J15.S3(SHIELD) J15.S4(SHIELD) U8.3(GND1) U8.8(GND2) U9.3(GND1) U9.8(GND2) U10.3(GND1) U10.8(GND2)
VCC3V3_SYS: D7.1(A)  [project net U27_VCC]
VCC_3V0: Q3.3(G) Q4.3(G) Q5.3(G) R41.2 R43.2 R45.2
VCC_SYS: C41.1 C42.1 D8.1(A) ED12.1(A1) J9.18 J15.18
DDC_SCL: J9.15 J15.15 Q4.1(D) R44.1 U8.2(IN2) U8.9(OUT2)
DDC_SDA: J9.16 J15.16 Q5.1(D) R46.1 U8.4(IN3) U8.7(OUT3)
HDMI_CEC: Q3.2(S) R41.1
HDMI_TX0NA: J9.9 J15.9 L15.3 R309.1 U10.2(IN2) U10.9(OUT2)
HDMI_TX0PA: J9.7 J15.7 L15.4 R308.1 U10.1(IN1) U10.10(OUT1)
HDMI_TX1NA: J9.6 J15.6 L14.3 R306.1 U9.5(IN4) U9.6(OUT4)
HDMI_TX1PA: J9.4 J15.4 L14.4 R307.1 U9.4(IN3) U9.7(OUT3)
HDMI_TX2NA: J9.3 J15.3 L8.3 R305.1 U9.2(IN2) U9.9(OUT2)
HDMI_TX2PA: J9.1 J15.1 L8.4 R304.1 U9.1(IN1) U9.10(OUT1)
HDMI_TXCNA: J9.12 J15.12 L16.3 R311.1 U10.5(IN4) U10.6(OUT4)
HDMI_TXCPA: J9.10 J15.10 L16.4 R310.1 U10.4(IN3) U10.7(OUT3)
I2C3_SCL_HDMI: Q4.2(S) R43.1 ; port I2C3_SCL_HDMI
I2C3_SDA_HDMI: Q5.2(S) R45.1 ; port I2C3_SDA_HDMI
PORT_CEC: J9.13 J15.13 Q3.1(D) R42.1 U8.1(IN1) U8.10(OUT1)
PORT_HPD: J9.19 J15.19 U8.5(IN4) U8.6(OUT4)
NetD7_2: D7.2(K) R42.2
NetD8_2: D8.2(K) R44.2 R46.2
NetJ38_204: L8.1 R304.2 ; port HDMI_TX_2P
NetJ38_206: L8.2 R305.2 ; port HDMI_TX_2N
NetJ38_208: L14.1 R307.2 ; port HDMI_TX_1P
NetJ38_210: L14.2 R306.2 ; port HDMI_TX_1N
NetJ38_212: L15.1 R308.2 ; port HDMI_TX_0P
NetJ38_214: L15.2 R309.2 ; port HDMI_TX_0N
NetJ38_216: L16.1 R310.2 ; port HDMI_TX_CP
NetJ38_218: L16.2 R311.2 ; port HDMI_TX_CN

Not connected (* = marked no-connect by the designer): J9 14*; J15 14*

### Notes on the sheet
- HDMI OUT
- [page 11 of 21 - PDF]
  - Create:  SOT.SchLib
  - No footprint: U8, U9, U10
- (in symbol 1SMB54CAT3) E0402
- (in symbol L-SMD-2) L1; NC/CMF1210DH900MFR; L2; DNP

### Library data of the parts
C41 C42 = Cap: Capacitor; Published: 8-Jun-2000; LatestRevisionDate: 17-Jul-2002; LatestRevisionNote: Re-released for DXP Platform.; PackageReference: RAD-0.3; Publisher: Altium Limited; PackageDescription: Radial Cap, Thru-Hole; 2 Leads; 0.3 in Pin Spacing
D7 D8 = Diode SMD: Default Diode; Code - JEDEC: DO-214-AB; Published: 8-Jun-2000; Revision: July-2002: Re-released for DXP Platform.; Publisher: Altium Limited
ED12 = 1SMB54CAT3: as ED13-ED16 on sheet HOST_PORT-USB2.0; DatasheetVersion: Rev. A; PackageVersion: Rev. A, 01/2000; PackageReference: SMB-2-403C-01; PackageDescription: 2-Pin Small Molded Package, J-Bend Lead, Body 4.315 x 3.555 mm; Supplier 1: Digi-Key; Supplier Part Number 1: 1SMB54CAT3-ND; Direction: Bidirectional; Packing: Tape and Reel; Mounting Technology: Surface Mount; PartNumber: 1SMB54CAT3; ComponentLink1Description: Manufacturer URL; ComponentLink1URL: http://www.onsemi.com/; ComponentLink2Description: Datasheet; ComponentLink2URL: http://www.onsemi.com/pub_link/Collateral/1SMB10CAT3-D.PDF; ComponentLink3Description: Package Specification; ComponentLink3URL: http://www.onsemi.com/pub_link/Collateral/1SMB10CAT3-D.PDF
J9 J15 = 10029449-001RLF: Connector, Hdmi Type a, Receptacle, 19 Position, Full Reel; MF: Amphenol ICC; MP: 10029449-001RLF; Availability: Unavailable; SnapEDA_Link: https://www.snapeda.com/parts/10029449-001RLF/Amphenol%20ICC/view-part/?ref=snap; Price: None; Value: *
  J9: Package: None
L8 L14-L16 = L-SMD-2: as L17 on sheet TYPE_CO-USB3.0; ComponentLink1Description: Manufacturer; ComponentLink1URL: http://www.we-online.de; Created by: Christin Otto; Created Date: August 2013; ComponentLink2Description: Datasheet; ComponentLink2URL: http://katalog.we-online.de/pbs/datasheet/7448709022.pdf
Q3-Q5 = ZXM61N02F: 20V N-Channel Enhancement Mode MOSFET; Published: 17-Dec-2003; DatasheetVersion: May-99; PackageVersion: 1996; PackageReference: SOT23; Publisher: Altium Limited; PackageDescription: SOT-23; 3 Leads; Body 3.1 x 2.5 mm, inc. leads (LxW max), Alternate Lead Configuration; ComponentLink1Description: Manufacturer Link; ComponentLink1URL: http://www.zetex.com/; ComponentLink2Description: Datasheet; ComponentLink2URL: www.zetex.com/3.0/pdf/ZXM61N02F.pdf
R41-R46 R304-R311 = Res-SMD: as R47-R56 on sheet HOST_PORT-USB2.0; Published: 08/06/2000; Publisher: Altium Hobart Technology Centre
U8-U10 = SLP2510P8

## Sheet HDMI_IN.SchDoc
size C
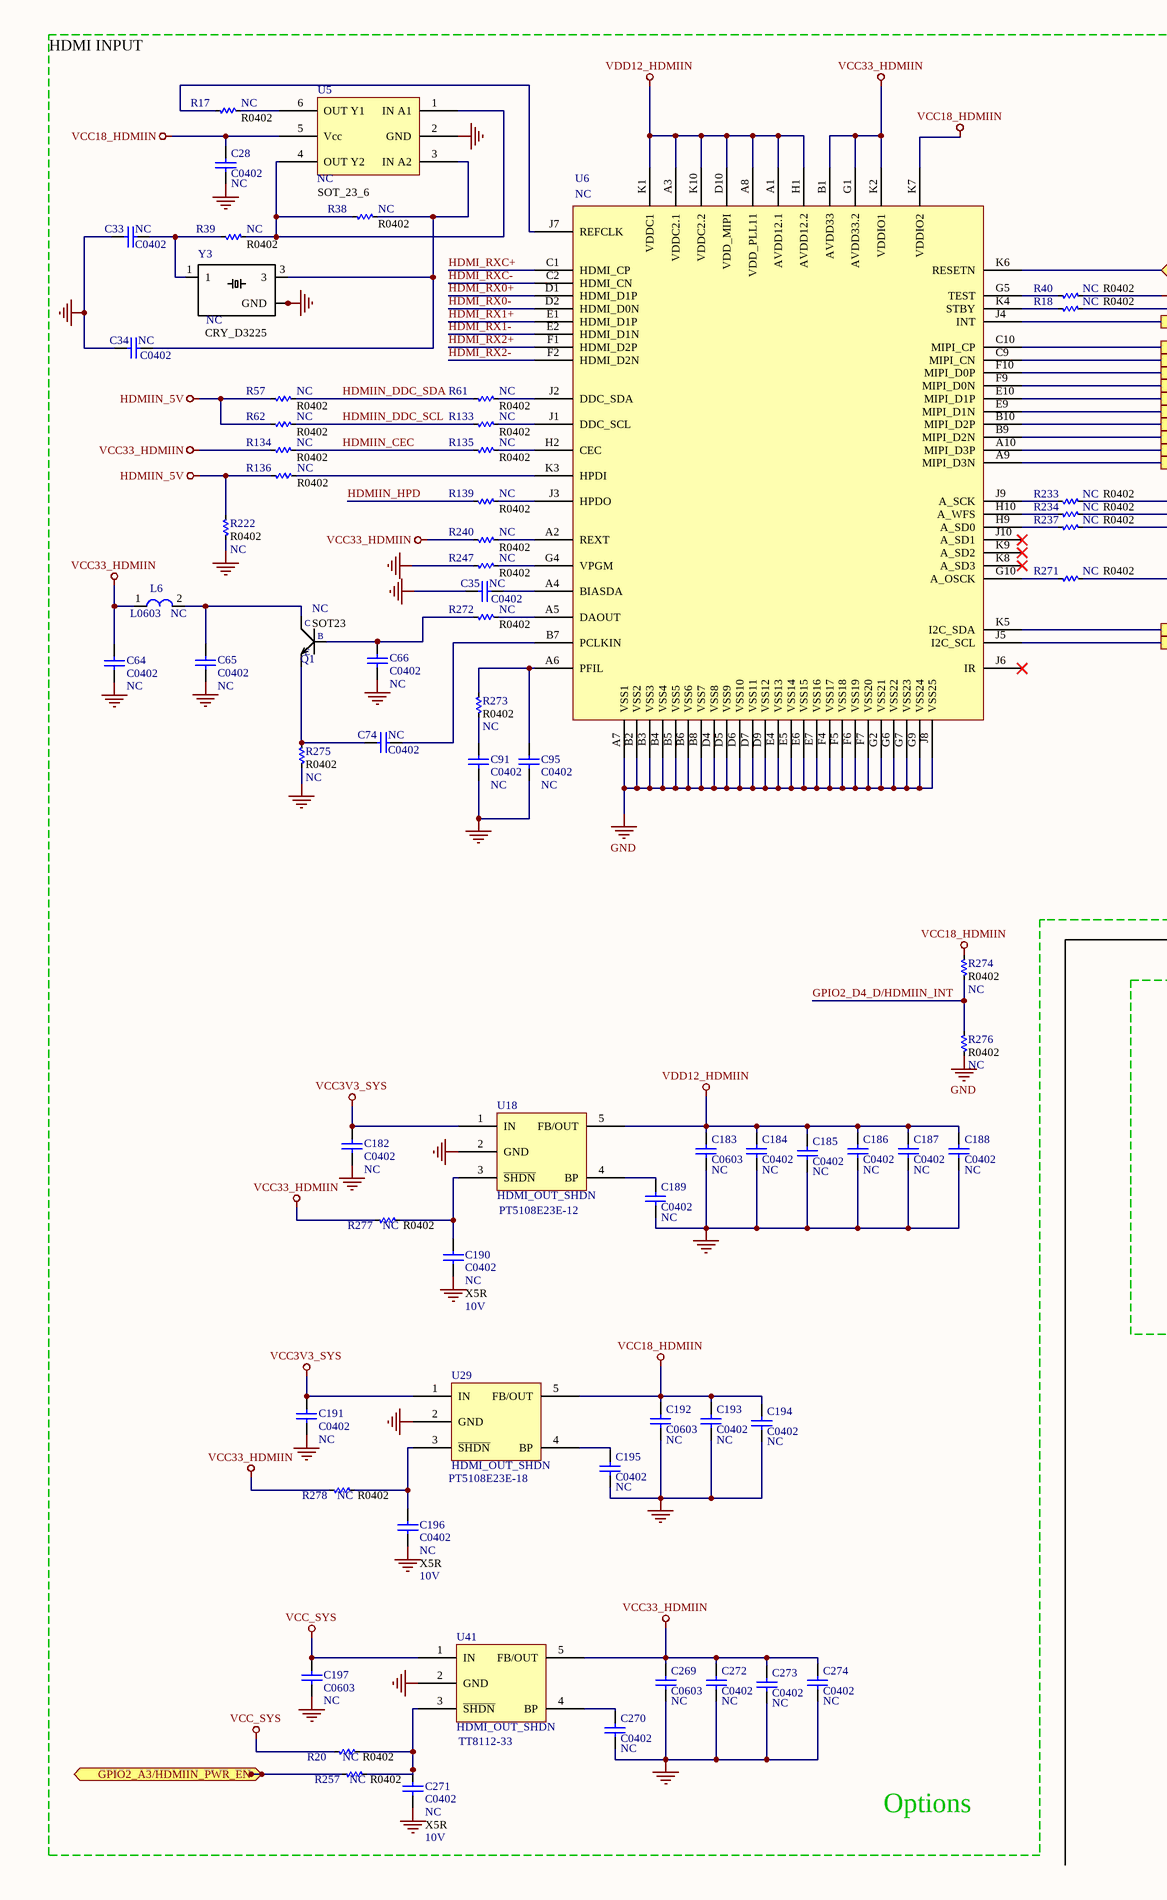
[diagram p13: HDMI_IN.SchDoc, left]
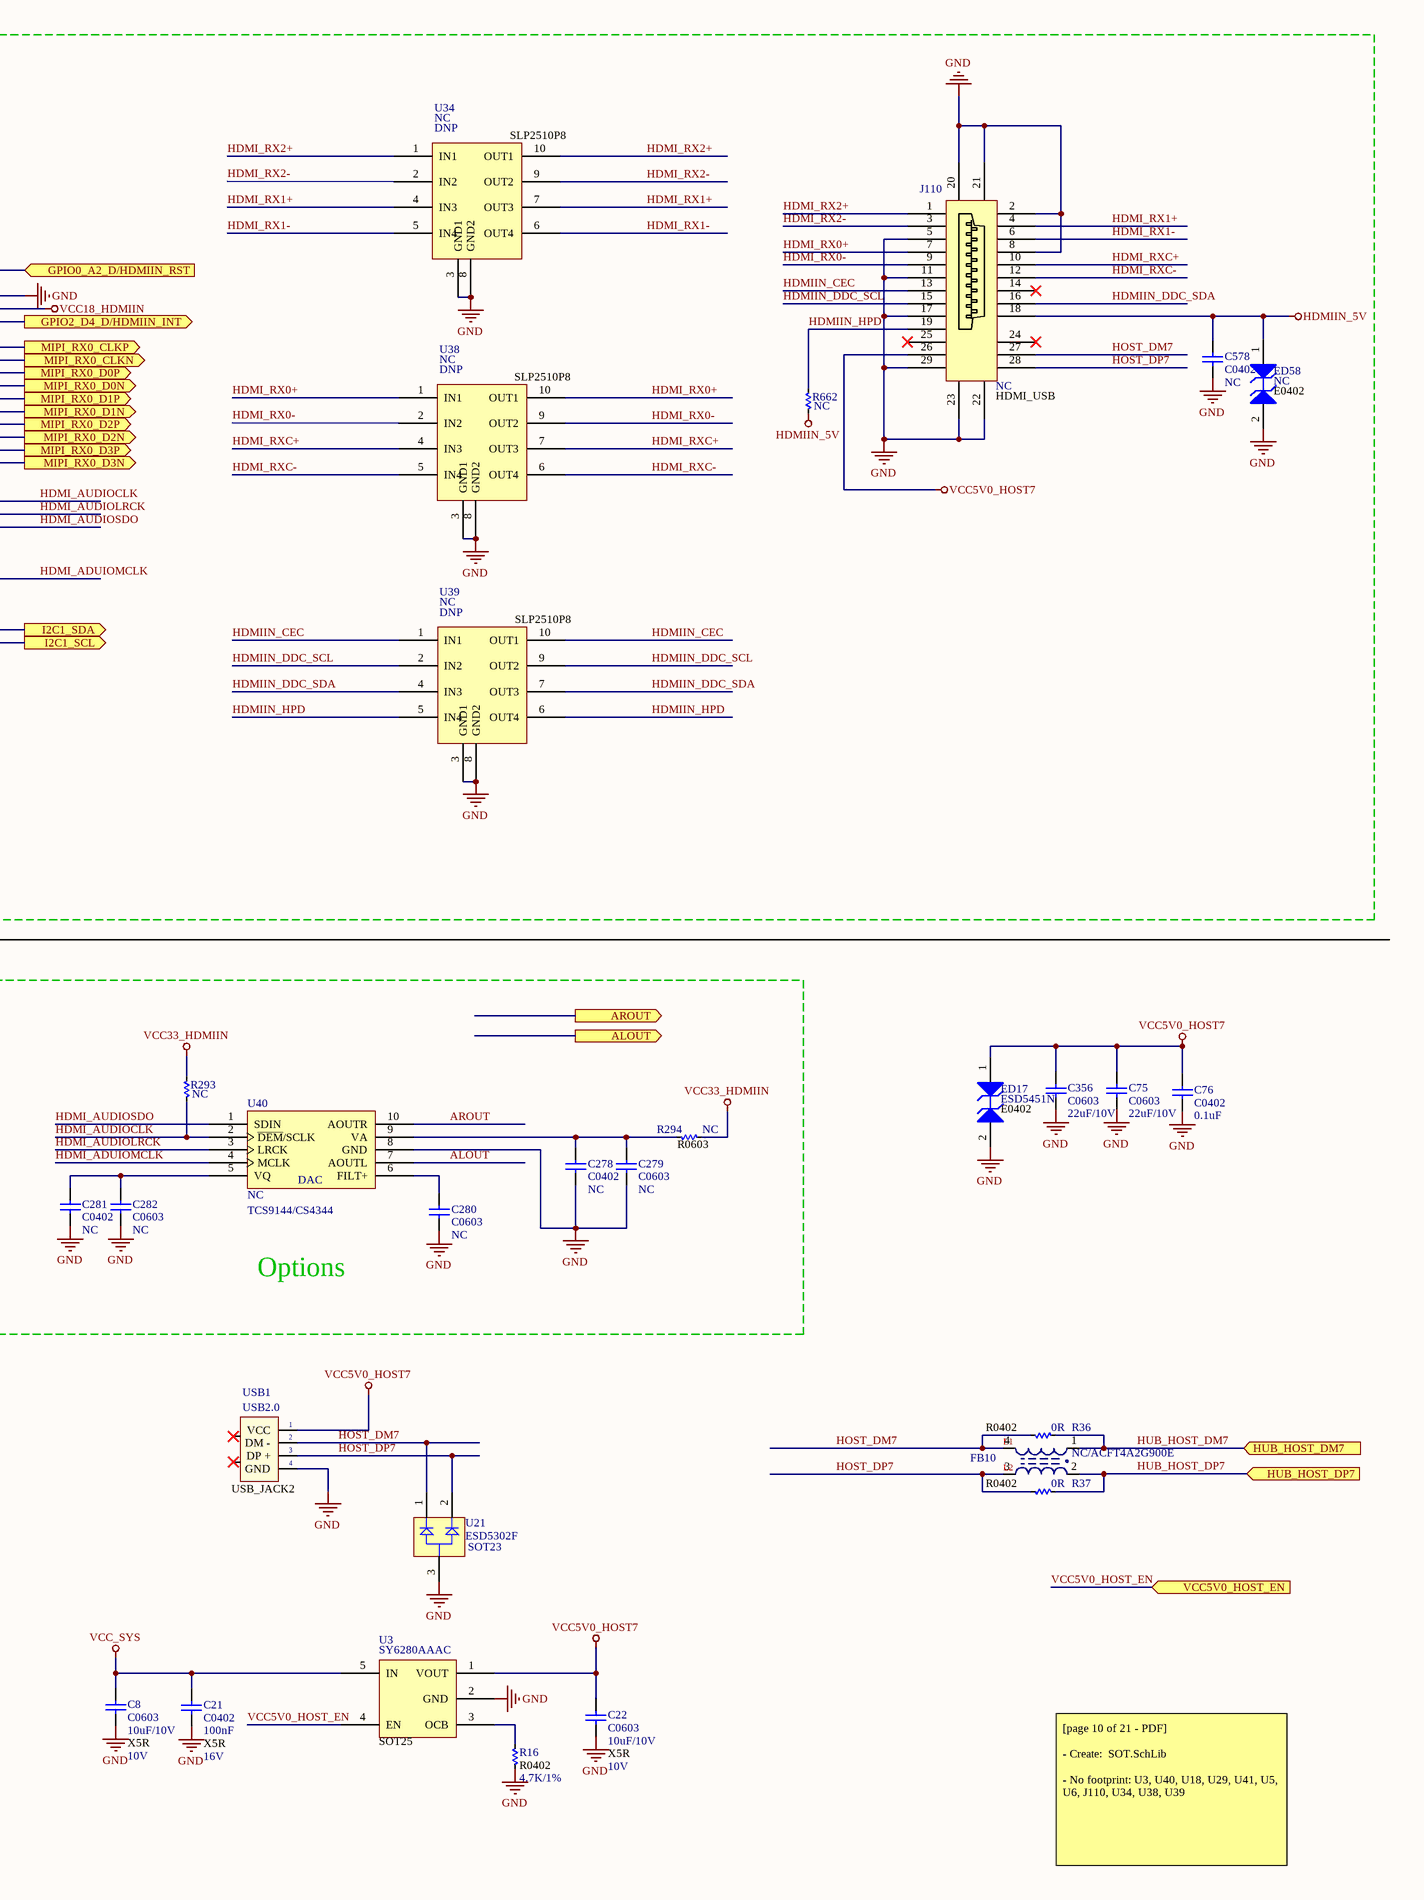
[diagram p14: HDMI_IN.SchDoc, right]

### Parts
C8  C0603  value 10uF/10V  [C 0603]
C21  C0402  value 100nF  [C 0402]
C22  C0603  value 10uF/10V  [C 0603]
C28  C0402  value NC  [C 0402]
C33  C0402  value NC  [C 0402]
C34  C0402  value NC  [C 0402]
C35  C0402  value NC  [C 0402]
C64  C0402  value NC  [C 0402]
C65  C0402  value NC  [C 0402]
C66  C0402  value NC  [C 0402]
C74  C0402  value NC  [C 0402]
C75  C0603  value 22uF/10V  [C 0603]
C76  C0402  value 0.1uF  [C 0402]
C91  C0402  value NC  [C 0402]
C95  C0402  value NC  [C 0402]
C182  C0402  value NC  [C 0402]
C183  C0603  value NC  [C 0603]
C184  C0402  value NC  [C 0402]
C185  C0402  value NC  [C 0402]
C186  C0402  value NC  [C 0402]
C187  C0402  value NC  [C 0402]
C188  C0402  value NC  [C 0402]
C189  C0402  value NC  [C 0402]
C190  C0402  value NC  [C 0402]
C191  C0402  value NC  [C 0402]
C192  C0603  value NC  [C 0603]
C193  C0402  value NC  [C 0402]
C194  C0402  value NC  [C 0402]
C195  C0402  value NC  [C 0402]
C196  C0402  value NC  [C 0402]
C197  C0603  value NC  [C 0603]
C269  C0603  value NC  [C 0603]
C270  C0402  value NC  [C 0402]
C271  C0402  value NC  [C 0402]
C272  C0402  value NC  [C 0402]
C273  C0402  value NC  [C 0402]
C274  C0402  value NC  [C 0402]
C278  C0402  value NC  [C 0402]
C279  C0603  value NC  [C 0603]
C280  C0603  value NC  [C 0603]
C281  C0402  value NC  [C 0402]
C282  C0603  value NC  [C 0603]
C356  C0603  value 22uF/10V  [C 0603]
C578  C0402  value NC  [C 0402]
ED17  ESD5451N  [DFN1006-2L]
ED58  ESD5451N  [DFN1006-2L]  (value not drawn)
FB10  RP2_0405  [L-SMD-D-7.3x7.3]  (value not drawn)
J110  HDMI_USB  value NC
L6  L0603  Inductance: NC  [L-SMD-M-12x10]
Q1  value NC  [*SOT-23]  (hidden comment: 8050)
R16  R0402  value 4.7K/1%  [R 0402]
R17  R0402  value NC  [R 0402]
R18  R0402  value NC  [R 0402]
R20  R0402  value NC  [R 0402]
R36  R0402  value 0R  [R 0402]
R37  R0402  value 0R  [R 0402]
R38  R0402  value NC  [R 0402]
R39  R0402  value NC  [R 0402]
R40  R0402  value NC  [R 0402]
R57  R0402  value NC  [R 0402]
R61  R0402  value NC  [R 0402]
R62  R0402  value NC  [R 0402]
R133  R0402  value NC  [R 0402]
R134  R0402  value NC  [R 0402]
R135  R0402  value NC  [R 0402]
R136  R0402  value NC  [R 0402]
R139  R0402  value NC  [R 0402]
R222  R0402  value NC  [R 0402]
R233  R0402  value NC  [R 0402]
R234  R0402  value NC  [R 0402]
R237  R0402  value NC  [R 0402]
R240  R0402  value NC  [R 0402]
R247  R0402  value NC  [R 0402]
R257  R0402  value NC  [R 0402]
R271  R0402  value NC  [R 0402]
R272  R0402  value NC  [R 0402]
R273  R0402  value NC  [R 0402]
R274  R0402  value NC  [R 0402]
R275  R0402  value NC  [R 0402]
R276  R0402  value NC  [R 0402]
R277  R0402  value NC  [R 0402]
R278  R0402  value NC  [R 0402]
R293  value NC  [R 0402]  (hidden comment: R0402)
R294  R0603  value NC  [R 0603]
R662  value NC  [R 0402]  (hidden comment: R0402)
U3  SY6280AAAC  Package: SOT25  [DCK5_N]
U5  value NC  Package: SOT_23_6  [SOT-23-6]  (hidden comment: HDMI_IN_SOT236)
U6  value NC  [TC358749XBG-80pin]  (hidden comment: HDMI_IN)
U18  HDMI_OUT_SHDN  [TI-DDC5_N]
U21  ESD5302F  PackageReference: SOT23  [INF-SOT23_N]
U29  HDMI_OUT_SHDN  [TI-DDC5_N]
U34  NC  [RCLAMP0524PATCT]
U38  NC  [RCLAMP0524PATCT]
U39  NC  [RCLAMP0524PATCT]
U40  DAC  value NC  [TSSOP-10]
U41  HDMI_OUT_SHDN  [TI-DDC5_N]
USB1  value USB2.0  [USB-S1]  (hidden comment: USB-S)
Y3  NC  [Crystal 4-SMD 32x25]

### Blocks framed on the sheet
Options: C28 C33-C35 C64-C66 C74 C91 C95 C182-C197 C269-C274 C578 ED58 J110 L6 Q1 R17 R18 R20 R38-R40 R57 R61 R62 R133-R136 R139 R222 R233 R234 R237 R240 R247 R257 R271-R278 R662 U5 U6 U18 U29 U34 U38 U39 U41 Y3
Options: C278-C282 R293 R294 U40

### Ports
ALOUT (out), AROUT (out), GPIO0_A2_D/HDMIIN_RST (in), GPIO2_A3/HDMIIN_PWR_EN (in), GPIO2_D4_D/HDMIIN_INT (out), HUB_HOST_DM7 (in), HUB_HOST_DP7 (in), I2C1_SCL (out), I2C1_SDA (out), MIPI_RX0_CLKN (out), MIPI_RX0_CLKP (out), MIPI_RX0_D0N (out), MIPI_RX0_D0P (out), MIPI_RX0_D1N (out), MIPI_RX0_D1P (out), MIPI_RX0_D2N (out), MIPI_RX0_D2P (out), MIPI_RX0_D3N (out), MIPI_RX0_D3P (out), VCC5V0_HOST_EN (in)

### Nets
GND: C8.2 C21.2 C22.2 C28.2 C33.1 C34.1 C35.1 C64.1 C65.1 C66.1 C75.2 C76.2 C91.1 C95.1 C182.2 C183.2 C184.2 C185.2 C186.2 C187.2 C188.2 C189.2 C190.2 C191.2 C192.2 C193.2 C194.2 C195.2 C196.2 C197.2 C269.2 C270.2 C271.2 C272.2 C273.2 C274.2 C278.2 C279.2 C280.2 C281.2 C282.2 C356.2 C578.2 ED17.2(A2) ED58.2(A2) J110.2 J110.5 J110.8 J110.11 J110.17 J110.20 J110.21 J110.22 J110.23 J110.29 R16.1 R40.2 R222.1 R247.1 R275.1 R276.2 U3.2(GND) U5.2(GND) U6.A7(VSS1) U6.B2(VSS2) U6.B3(VSS3) U6.B4(VSS4) U6.B5(VSS5) U6.B6(VSS6) U6.B8(VSS7) U6.D4(VSS8) U6.D5(VSS9) U6.D6(VSS10) U6.D7(VSS11) U6.D9(VSS12) U6.E4(VSS13) U6.E5(VSS14) U6.E6(VSS15) U6.E7(VSS16) U6.F4(VSS17) U6.F5(VSS18) U6.F6(VSS19) U6.F7(VSS20) U6.G2(VSS21) U6.G6(VSS22) U6.G7(VSS23) U6.G9(VSS24) U6.J8(VSS25) U18.2(GND) U21.3(A) U29.2(GND) U34.3(GND1) U34.8(GND2) U38.3(GND1) U38.8(GND2) U39.3(GND1) U39.8(GND2) U40.8(GND) U41.2(GND) USB1.4(GND) Y3.2(GND) Y3.4(GND)
HDMIIN_5V: C578.1 ED58.1(A1) J110.18 R57.1 R62.1 R136.1 R222.2 R662.1
VCC3V3_SYS: C182.1 C191.1 U18.1(IN) U29.1(IN)  [project net U27_VCC]
VCC5V0_HOST7: C22.1 C75.1 C76.1 C356.1 ED17.1(A1) J110.26 U3.1(VOUT) USB1.1(VCC)
VCC18_HDMIIN: C28.1 C192.1 C193.1 C194.1 R18.2 R274.1 U5.5(Vcc) U6.K7(VDDIO2) U29.5(FB/OUT)
VCC33_HDMIIN: C64.2 C269.1 C272.1 C273.1 C274.1 L6.1 R134.1 R240.1 R277.2 R278.2 R293.2 R294.1 U6.B1(AVDD33) U6.G1(AVDD33.2) U6.K2(VDDIO1) U41.5(FB/OUT)
VCC_SYS: C8.1 C21.1 C197.1 R20.2 U3.5(IN) U41.1(IN)
VDD12_HDMIIN: C183.1 C184.1 C185.1 C186.1 C187.1 C188.1 U6.A1(AVDD12.1) U6.A3(VDDC2.1) U6.A8(VDD_PLL11) U6.D10(VDD_MIPI) U6.H1(AVDD12.2) U6.K1(VDDC1) U6.K10(VDDC2.2) U18.5(FB/OUT)
ALOUT: U40.7(AOUTL)
AROUT: U40.10(AOUTR)
GPIO2_D4_D/HDMIIN_INT: R274.2 R276.1
HDMI_ADUIOMCLK: R271.2 U40.4(MCLK)
HDMI_AUDIOCLK: R233.2 R293.1 U40.2(~{DEM}/SCLK)
HDMI_AUDIOLRCK: R234.2 U40.3(LRCK)
HDMI_AUDIOSDO: R237.2 U40.1(SDIN)
HDMI_RX0+: J110.7 U6.D1(HDMI_D1P) U38.1(IN1) U38.10(OUT1)
HDMI_RX0-: J110.9 U6.D2(HDMI_D0N) U38.2(IN2) U38.9(OUT2)
HDMI_RX1+: J110.4 U6.E1(HDMI_D1P) U34.4(IN3) U34.7(OUT3)
HDMI_RX1-: J110.6 U6.E2(HDMI_D1N) U34.5(IN4) U34.6(OUT4)
HDMI_RX2+: J110.1 U6.F1(HDMI_D2P) U34.1(IN1) U34.10(OUT1)
HDMI_RX2-: J110.3 U6.F2(HDMI_D2N) U34.2(IN2) U34.9(OUT2)
HDMI_RXC+: J110.10 U6.C1(HDMI_CP) U38.4(IN3) U38.7(OUT3)
HDMI_RXC-: J110.12 U6.C2(HDMI_CN) U38.5(IN4) U38.6(OUT4)
HDMIIN_CEC: J110.13 R134.2 R135.1 U39.1(IN1) U39.10(OUT1)
HDMIIN_DDC_SCL: J110.15 R62.2 R133.1 U39.2(IN2) U39.9(OUT2)
HDMIIN_DDC_SDA: J110.16 R57.2 R61.1 U39.4(IN3) U39.7(OUT3)
HDMIIN_HPD: J110.19 R139.1 R662.2 U39.5(IN4) U39.6(OUT4)
HOST_DM7: FB10.4 J110.27 R36.1 U21.1(K1) USB1.2(DM_-)
HOST_DP7: FB10.3 J110.28 R37.1 U21.2(K2) USB1.3(DP_+)
HUB_HOST_DM7: FB10.1 R36.2 ; port HUB_HOST_DM7
HUB_HOST_DP7: FB10.2 R37.2 ; port HUB_HOST_DP7
I2C1_SCL: U6.J5(I2C_SCL) ; port I2C1_SCL
I2C1_SDA: U6.K5(I2C_SDA) ; port I2C1_SDA
MIPI_RX0_CLKN: U6.C9(MIPI_CN) ; port MIPI_RX0_CLKN
MIPI_RX0_CLKP: U6.C10(MIPI_CP) ; port MIPI_RX0_CLKP
MIPI_RX0_D0N: U6.F9(MIPI_D0N) ; port MIPI_RX0_D0N
MIPI_RX0_D0P: U6.F10(MIPI_D0P) ; port MIPI_RX0_D0P
MIPI_RX0_D1N: U6.E9(MIPI_D1N) ; port MIPI_RX0_D1N
MIPI_RX0_D1P: U6.E10(MIPI_D1P) ; port MIPI_RX0_D1P
MIPI_RX0_D2N: U6.B9(MIPI_D2N) ; port MIPI_RX0_D2N
MIPI_RX0_D2P: U6.B10(MIPI_D2P) ; port MIPI_RX0_D2P
MIPI_RX0_D3N: U6.A9(MIPI_D3N) ; port MIPI_RX0_D3N
MIPI_RX0_D3P: U6.A10(MIPI_D3P) ; port MIPI_RX0_D3P
VCC5V0_HOST_EN: U3.4(EN) ; port VCC5V0_HOST_EN
NetC33_2: C33.2 R39.1 Y3.1
NetC34_2: C34.2 R38.2 U5.3(IN_A2) Y3.3
NetC35_2: C35.2 U6.A4(BIASDA)
NetC65_2: C65.2 L6.2 Q1.3(C)
NetC66_2: C66.2 Q1.1(B) R272.1
NetC74_1: C74.1 U6.B7(PCLKIN)
NetC74_2: C74.2 Q1.2(E) R275.2
NetC91_2: C91.2 R273.1
NetC95_2: C95.2 R273.2 U6.A6(PFIL)
NetC189_1: C189.1 U18.4(BP)
NetC190_1: C190.1 R277.1 U18.3(~{SHDN})
NetC195_1: C195.1 U29.4(BP)
NetC196_1: C196.1 R278.1 U29.3(~{SHDN})
NetC270_1: C270.1 U41.4(BP)
NetC271_1: C271.1 R20.1 R257.1 U41.3(~{SHDN})
NetC278_1: C278.1 C279.1 R294.2 U40.9(VA)
NetC280_1: C280.1 U40.6(FILT+)
NetC281_1: C281.1 C282.1 U40.5(VQ)
NetJ38_71: R257.2 ; port GPIO2_A3/HDMIIN_PWR_EN
NetJ38_114: U6.J4(INT) ; port GPIO2_D4_D/HDMIIN_INT
NetJ38_183: U6.K6(RESETN) ; port GPIO0_A2_D/HDMIIN_RST
NetR16_2: R16.2 U3.3(OCB)
NetR17_1: R17.1 U6.J7(REFCLK)
NetR17_2: R17.2 U5.6(OUT_Y1)
NetR18_1: R18.1 U6.K4(STBY)
NetR38_1: R38.1 R39.2 U5.1(IN_A1) U5.4(OUT_Y2)
NetR40_1: R40.1 U6.G5(TEST)
NetR61_2: R61.2 U6.J2(DDC_SDA)
NetR133_2: R133.2 U6.J1(DDC_SCL)
NetR135_2: R135.2 U6.H2(CEC)
NetR136_2: R136.2 U6.K3(HPDI)
NetR139_2: R139.2 U6.J3(HPDO)
NetR233_1: R233.1 U6.J9(A_SCK)
NetR234_1: R234.1 U6.H10(A_WFS)
NetR237_1: R237.1 U6.H9(A_SD0)
NetR240_2: R240.2 U6.A2(REXT)
NetR247_2: R247.2 U6.G4(VPGM)
NetR271_1: R271.1 U6.G10(A_OSCK)
NetR272_2: R272.2 U6.A5(DAOUT)

Not connected (* = marked no-connect by the designer): J110 14* 24* 25*; U6 J6(IR)* J10(A_SD1)* K8(A_SD3)* K9(A_SD2)*; USB1 5* 6*

### Notes on the sheet
- HDMI INPUT
- [page 10 of 21 - PDF]
  - Create:  SOT.SchLib
  - No footprint: U3, U40, U18, U29, U41, U5, U6, J110, U34, U38, U39
- (in symbol 1SMB54CAT3) E0402; NC
- (in symbol ABM8-30.000MHZ-10-1-U-T) CRY_D3225
- (in symbol Cap) X5R; 10V; 16V
- (in symbol HDMI_OUT_DAC) TCS9144/CS4344
- (in symbol HDMI_OUT_SHDN) PT5108E23E-12; PT5108E23E-18; TT8112-33
- (in symbol L-SMD-2) L1; NC/ACFT4A2G900E; L2
- (in symbol SLP2510P8) DNP
- (in symbol SMD-TRANSISTORS-NPN-25V-500MW(SOT-23)) SOT23
- (in symbol USB_S) USB_JACK2

### Library data of the parts
C8 C21 C22 C28 C33-C35 C64-C66 C74-C76 C91 C95 C182-C197 C269-C274 C278-C282 C356 C578 = Cap: Capacitor; Published: 8-Jun-2000; LatestRevisionDate: 17-Jul-2002; LatestRevisionNote: Re-released for DXP Platform.; PackageReference: RAD-0.3; Publisher: Altium Limited; PackageDescription: Radial Cap, Thru-Hole; 2 Leads; 0.3 in Pin Spacing
ED17 ED58 = 1SMB54CAT3: as ED13-ED16 on sheet HOST_PORT-USB2.0; DatasheetVersion: Rev. A; PackageVersion: Rev. A, 01/2000; PackageReference: SMB-2-403C-01; PackageDescription: 2-Pin Small Molded Package, J-Bend Lead, Body 4.315 x 3.555 mm; Supplier 1: Digi-Key; Supplier Part Number 1: 1SMB54CAT3-ND; Direction: Bidirectional; Packing: Tape and Reel; Mounting Technology: Surface Mount; PartNumber: 1SMB54CAT3; ComponentLink1Description: Manufacturer URL; ComponentLink1URL: http://www.onsemi.com/; ComponentLink2Description: Datasheet; ComponentLink2URL: http://www.onsemi.com/pub_link/Collateral/1SMB10CAT3-D.PDF; ComponentLink3Description: Package Specification; ComponentLink3URL: http://www.onsemi.com/pub_link/Collateral/1SMB10CAT3-D.PDF
FB10 = L-SMD-2: as L17 on sheet TYPE_CO-USB3.0; ComponentLink1Description: Manufacturer; ComponentLink1URL: http://www.we-online.de; Created by: Christin Otto; Created Date: August 2013; ComponentLink2Description: Datasheet; ComponentLink2URL: http://katalog.we-online.de/pbs/datasheet/7448709022.pdf
J110 = HDMI_IN_USB
L6 = L-SMD-1: partNo: 78477010; Manufacturer: Wurth Elektronik; ComponentLink1Description: Manufacturer; ComponentLink1URL: http://www.we-online.de; Created by: Baojun Chen; Created Date: Nov.2015; ComponentLink2Description: Datasheet; ComponentLink2URL: http://katalog.we-online.de/pbs/datasheet/78477010.pdf
Q1 = SMD-TRANSISTORS-NPN-25V-500MW(SOT-23): MF: Recom Power; MP: S8050; Package: SMD-8 Samsung; Price: None; SnapEDA_Link: https://www.snapeda.com/parts/S8050/Recom%20Power/view-part/?ref=snap; Availability: Unavailable
R16-R18 R20 R36-R40 R57 R61 R62 R133-R136 R139 R222 R233 R234 R237 R240 R247 R257 R271-R278 R293 R294 R662 = Res-SMD: as R47-R56 on sheet HOST_PORT-USB2.0; Published: 08/06/2000; Publisher: Altium Hobart Technology Centre
U21 = BAS70-06: as U23 on sheet TYPE_CO-USB3.0; PackageVersion: Apr-08; PackageDescription: 3-Pin Small Outline Transistor Package, 1.3 x 2.9 mm Body, 0.95 mm Pitch; Packing: Reel; Mounting Technology: Surface Mount; PartNumber: BAS70-06; ComponentLink1Description: Manufacturer URL; ComponentLink1URL: http://www.infineon.com/; ComponentLink2Description: Datasheet; ComponentLink2URL: http://www.infineon.com/dgdl/bas70_bas170series.pdf?folderId=db3a30431400ef68011425f1ca2505e3&fileId=db3a304314dca389011518ad41680e12; ComponentLink3Description: Package Specification; ComponentLink3URL: http://www.infineon.com/dgdl/SOT23-Package_Overview.pdf?folderId=db3a30431936bc4b0119532290053c66&fileId=db3a30431936bc4b0119533468123c85
U34 U38 U39 = SLP2510P8
U40 = HDMI_OUT_DAC
USB1 = USB_S: USB connector
Y3 = ABM8-30.000MHZ-10-1-U-T: as Y1 on sheet HOST_PORT-USB2.0; SnapEDA_Link: https://www.snapeda.com/parts/ABM8-30.000MHZ-10-1-U-T/Abracon%20LLC/view-part/?ref=snap; MP: ABM8-30.000MHZ-10-1-U-T; Availability: Unavailable; Price: None; Package: SMD-4 Abracon; Value: *

## Sheet AUDIO_CODEC.SchDoc
size C
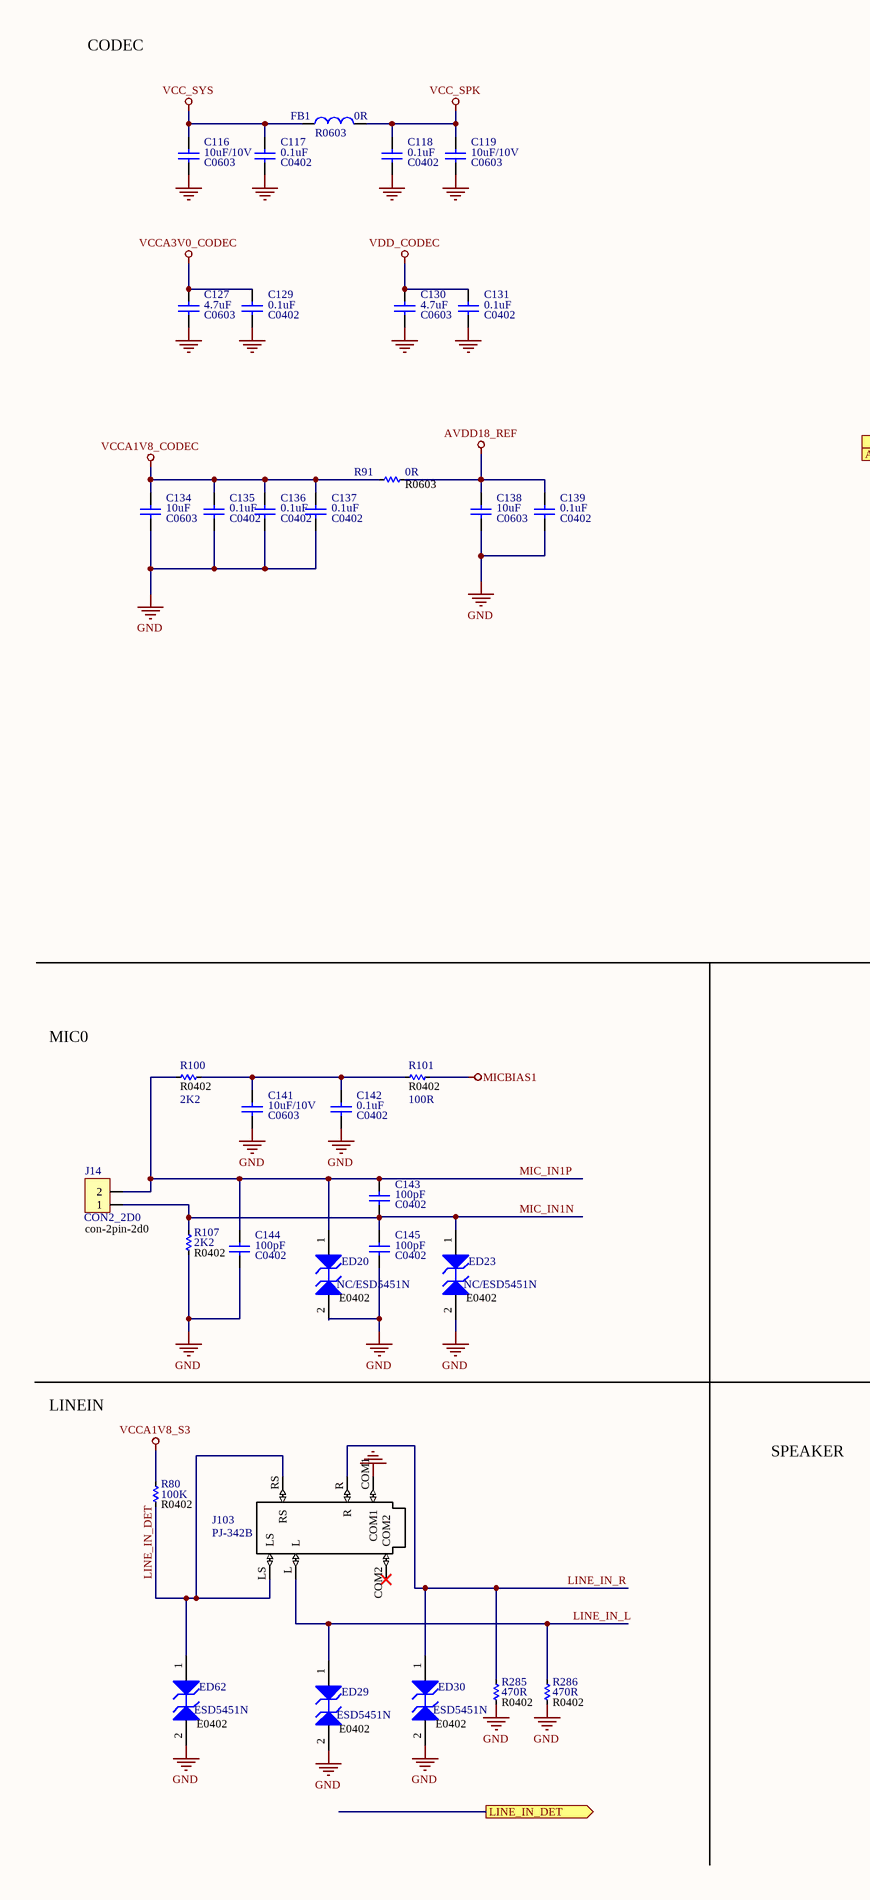
[diagram p15: AUDIO_CODEC.SchDoc, left]
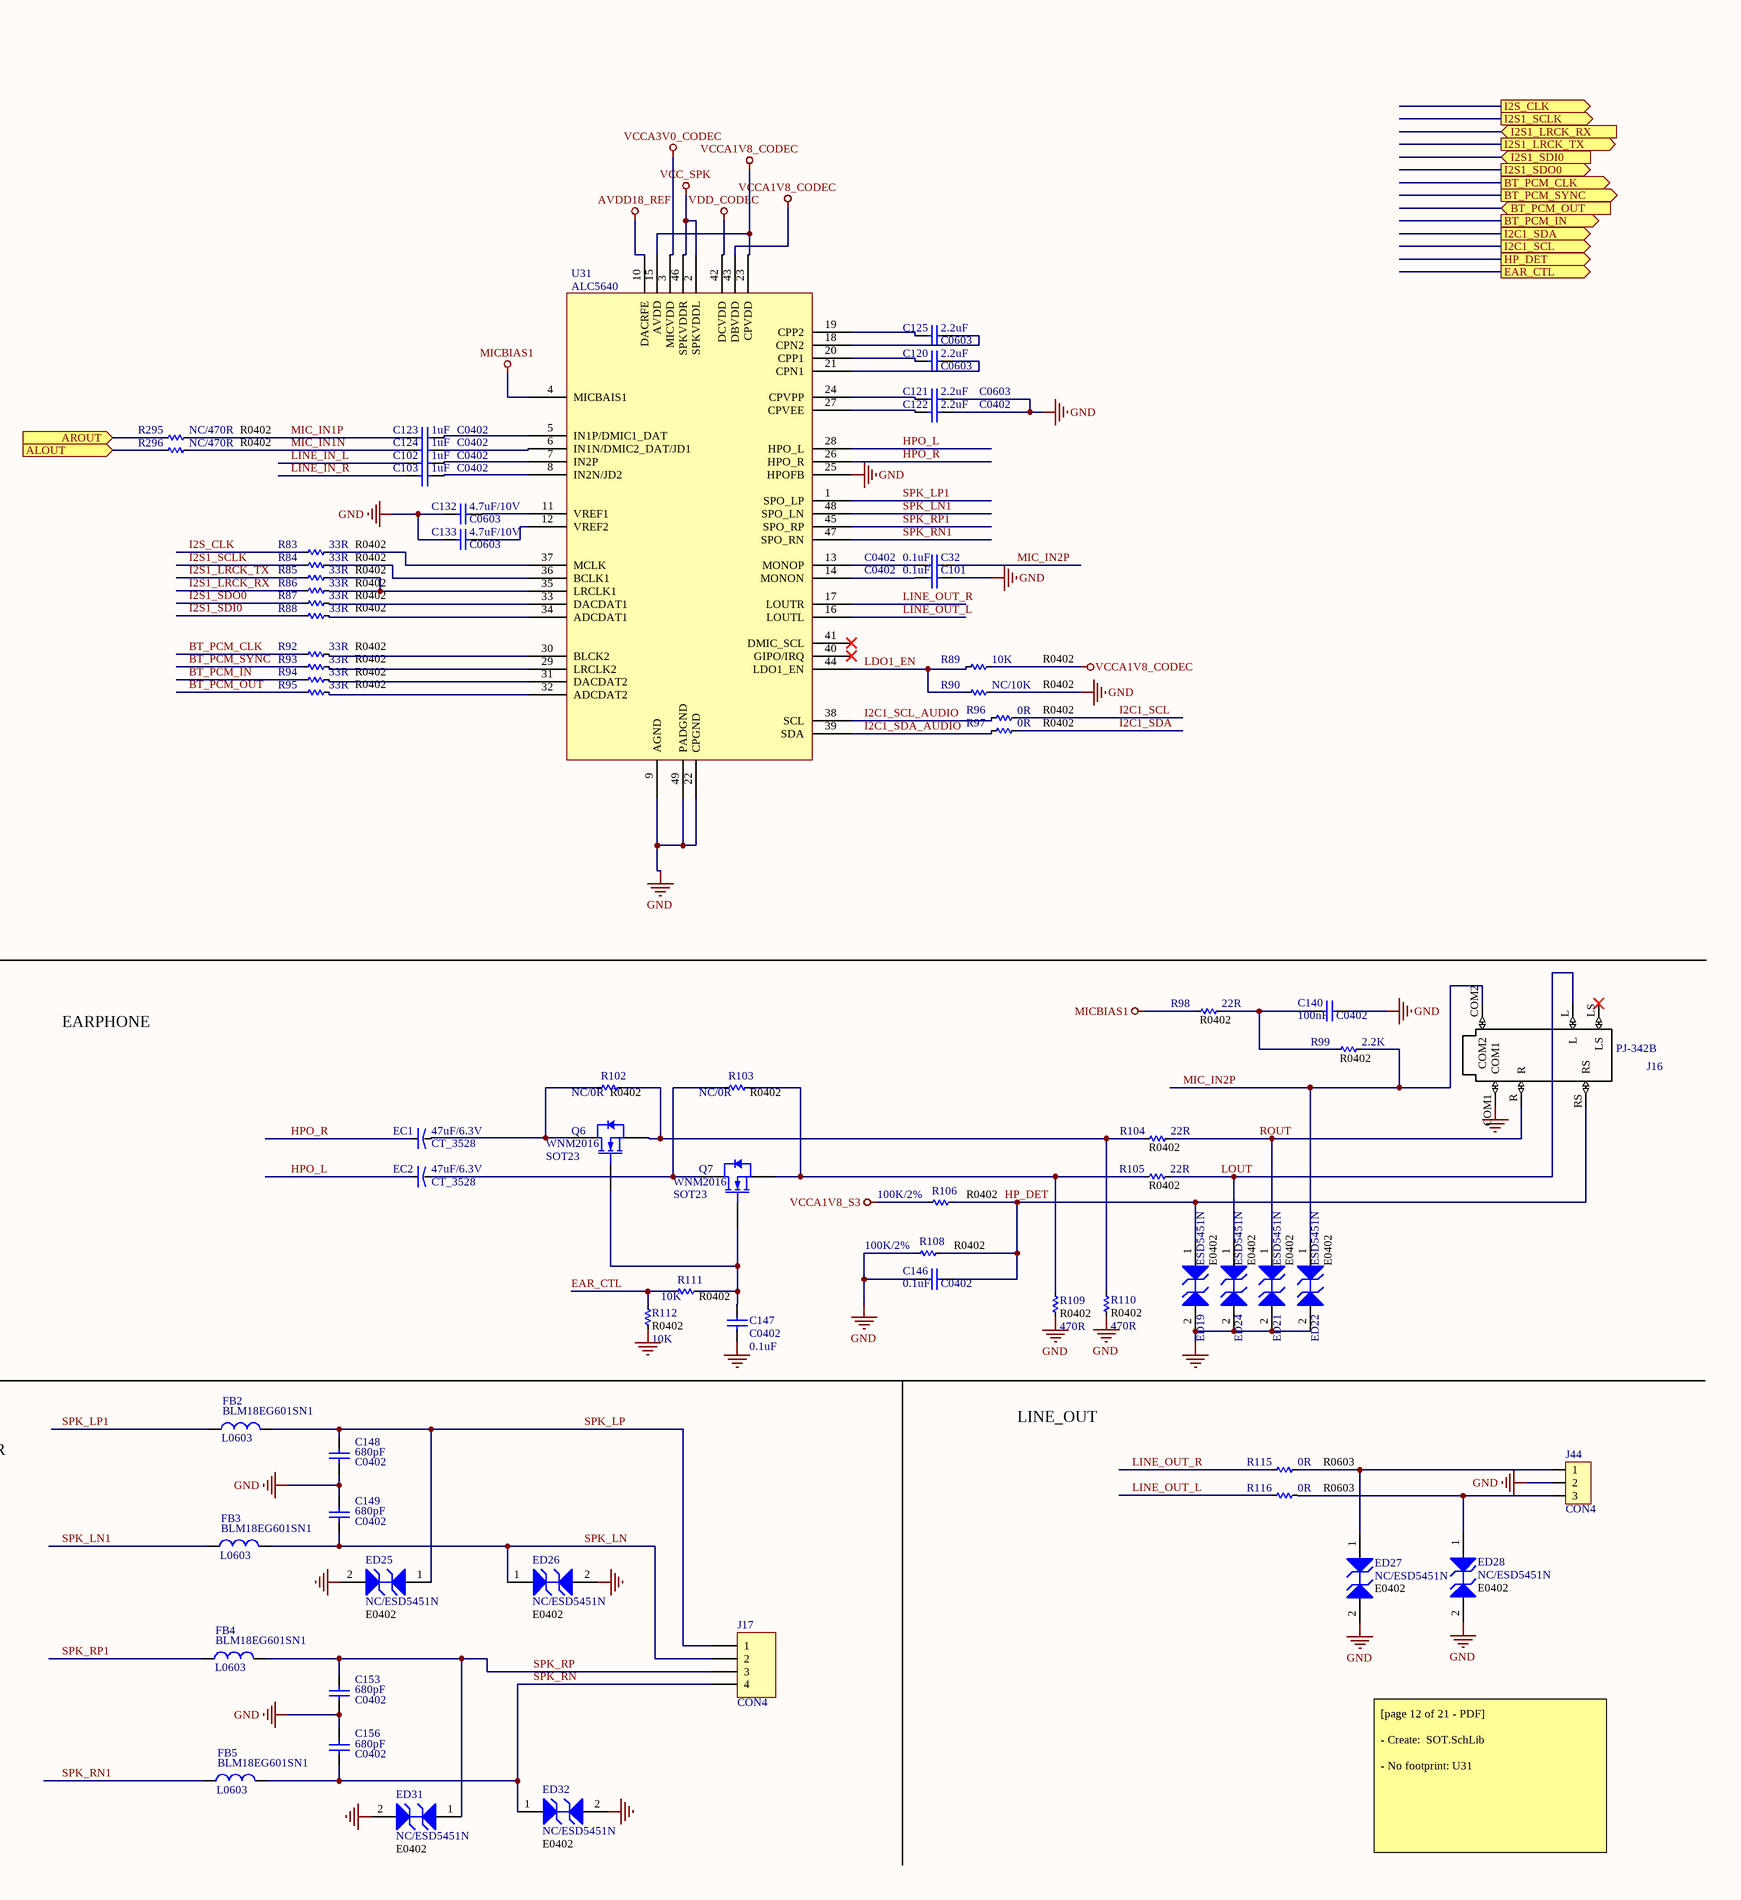
[diagram p16: AUDIO_CODEC.SchDoc, right]

### Parts
C32  C0402  value 0.1uF  [C 0402]
C101  C0402  value 0.1uF  [C 0402]
C102  C0402  value 1uF  [C 0402]
C103  C0402  value 1uF  [C 0402]
C116  C0603  value 10uF/10V  [C 0603]
C117  C0402  value 0.1uF  [C 0402]
C118  C0402  value 0.1uF  [C 0402]
C119  C0603  value 10uF/10V  [C 0603]
C120  C0603  value 2.2uF  [C 0603]
C121  C0603  value 2.2uF  [C 0603]
C122  C0402  value 2.2uF  [C 0402]
C123  C0402  value 1uF  [C 0402]
C124  C0402  value 1uF  [C 0402]
C125  C0603  value 2.2uF  [C 0603]
C127  C0603  value 4.7uF  [C 0603]
C129  C0402  value 0.1uF  [C 0402]
C130  C0603  value 4.7uF  [C 0603]
C131  C0402  value 0.1uF  [C 0402]
C132  C0603  value 4.7uF/10V  [C 0603]
C133  C0603  value 4.7uF/10V  [C 0603]
C134  C0603  value 10uF  [C 0603]
C135  C0402  value 0.1uF  [C 0402]
C136  C0402  value 0.1uF  [C 0402]
C137  C0402  value 0.1uF  [C 0402]
C138  C0603  value 10uF  [C 0603]
C139  C0402  value 0.1uF  [C 0402]
C140  C0402  value 100nF  [C 0402]
C141  C0603  value 10uF/10V  [C 0603]
C142  C0402  value 0.1uF  [C 0402]
C143  C0402  value 100pF  [C 0402]
C144  C0402  value 100pF  [C 0402]
C145  C0402  value 100pF  [C 0402]
C146  C0402  value 0.1uF  [C 0402]
C147  C0402  value 0.1uF  [C 0402]
C148  C0402  value 680pF  [C 0402]
C149  C0402  value 680pF  [C 0402]
C153  C0402  value 680pF  [C 0402]
C156  C0402  value 680pF  [C 0402]
EC1  value 47uF/6.3V  Package: CT_3528  [CAP-ALU-SMD-4.5x5x1.4]  (hidden comment: CN-ALU-SMD)
EC2  value 47uF/6.3V  Package: CT_3528  [CAP-ALU-SMD-4.5x5x1.4]  (hidden comment: CN-ALU-SMD)
ED19  ESD5451N  [DFN1006-2L]
ED20  NC/ESD5451N  [DFN1006-2L]
ED21  ESD5451N  [DFN1006-2L]
ED22  ESD5451N  [DFN1006-2L]
ED23  NC/ESD5451N  [DFN1006-2L]
ED24  ESD5451N  [DFN1006-2L]
ED25  NC/ESD5451N  [DFN1006-2L]
ED26  NC/ESD5451N  [DFN1006-2L]
ED27  NC/ESD5451N  [DFN1006-2L]
ED28  NC/ESD5451N  [DFN1006-2L]
ED29  ESD5451N  [DFN1006-2L]
ED30  ESD5451N  [DFN1006-2L]
ED31  NC/ESD5451N  [DFN1006-2L]
ED32  NC/ESD5451N  [DFN1006-2L]
ED62  ESD5451N  [DFN1006-2L]
FB1  R0603  [L/0.4]
FB2  L0603  [L/0.4]
FB3  L0603  [L/0.4]
FB4  L0603  [L/0.4]
FB5  L0603  [L/0.4]
J14  CON2_2D0  [Header2]
J16  PJ-342B  [*SUNTECH_ST-PJ-312_ST-PJ-312(Primary)]
J17  CON4  [CON4]
J44  CON4  [Header3]
J103  PJ-342B  [*SUNTECH_ST-PJ-312_ST-PJ-312(Primary)]
Q6  WNM2016  [SOT23]
Q7  WNM2016  [SOT23]
R80  R0402  value 100K  [R 0402]
R83  R0402  value 33R  [R 0402]
R84  R0402  value 33R  [R 0402]
R85  R0402  value 33R  [R 0402]
R86  R0402  value 33R  [R 0402]
R87  R0402  value 33R  [R 0402]
R88  R0402  value 33R  [R 0402]
R89  R0402  value 10K  [R 0402]
R90  R0402  value NC/10K  [R 0402]
R91  R0603  value 0R  [R 0603]
R92  R0402  value 33R  [R 0402]
R93  R0402  value 33R  [R 0402]
R94  R0402  value 33R  [R 0402]
R95  R0402  value 33R  [R 0402]
R96  R0402  value 0R  [R 0402]
R97  R0402  value 0R  [R 0402]
R98  R0402  value 22R  [R 0402]
R99  R0402  value 2.2K  [R 0402]
R100  R0402  value 2K2  [R 0402]
R101  R0402  value 100R  [R 0402]
R102  R0402  value NC/0R  [R 0402]
R103  R0402  value NC/0R  [R 0402]
R104  R0402  value 22R  [R 0402]
R105  R0402  value 22R  [R 0402]
R106  R0402  value 100K/2%  [R 0402]
R107  R0402  value 2K2  [R 0402]
R108  R0402  value 100K/2%  [R 0402]
R109  R0402  value 470R  [R 0402]
R110  R0402  value 470R  [R 0402]
R111  R0402  value 10K  [R 0402]
R112  R0402  value 10K  [R 0402]
R115  R0603  value 0R  [R 0603]
R116  R0603  value 0R  [R 0603]
R285  R0402  value 470R  [R 0402]
R286  R0402  value 470R  [R 0402]
R295  R0402  value NC/470R  [R 0402]
R296  R0402  value NC/470R  [R 0402]
U31  ALC5640  [QFN48]

### Ports
ALOUT (in), AROUT (in), BT_PCM_CLK (out), BT_PCM_IN (out), BT_PCM_OUT (in), BT_PCM_SYNC (out), EAR_CTL (out), HP_DET (out), I2C1_SCL (out), I2C1_SDA (out), I2S1_LRCK_RX (in), I2S1_LRCK_TX (out), I2S1_SCLK (out), I2S1_SDI0 (in), I2S1_SDO0 (out), I2S_CLK (out), LINE_IN_DET (out)

### Nets
AVDD18_REF: C138.1 C139.1 R91.2 U31.10(DACRFE)
GND: C101.2 C116.2 C117.2 C118.2 C119.2 C121.2 C122.2 C127.2 C129.2 C130.2 C131.2 C132.1 C133.1 C134.2 C135.2 C136.2 C137.2 C138.2 C139.2 C140.2 C141.2 C142.2 C144.2 C145.2 C146.1 C147.1 C148.2 C149.1 C153.2 C156.1 ED19.2(A2) ED20.2(A2) ED21.2(A2) ED22.2(A2) ED23.2(A2) ED24.2(A2) ED25.2(A2) ED26.2(A2) ED27.2(A2) ED28.2(A2) ED29.2(A2) ED30.2(A2) ED31.2(A2) ED32.2(A2) ED62.2(A2) J16.COM1 J44.2 J103.COM1 R90.2 R107.2 R108.2 R109.1 R110.1 R112.2 R285.2 R286.2 U31.9(AGND) U31.22(CPGND) U31.25(HPOFB) U31.49(PADGND)
MICBIAS1: R98.2 R101.2 U31.4(MICBAIS1)
VCC_SPK: C118.1 C119.1 FB1.2 U31.2(SPKVDDL) U31.46(SPKVDDR)
VCC_SYS: C116.1 C117.1 FB1.1
VCCA1V8_CODEC: C134.1 C135.1 C136.1 C137.1 R89.2 R91.1 U31.15(AVDD) U31.23(CPVDD) U31.43(DBVDD)
VCCA1V8_S3: R80.1 R106.2
VCCA3V0_CODEC: C127.1 C129.1 U31.3(MICVDD)
VDD_CODEC: C130.1 C131.1 U31.42(DCVDD)
BT_PCM_CLK: R92.1
BT_PCM_IN: R94.1
BT_PCM_OUT: R95.1
BT_PCM_SYNC: R93.1
EAR_CTL: R111.2 R112.1
HP_DET: C146.2 ED19.1(A1) J16.RS R106.1 R108.1
HPO_L: EC2.1 U31.28(HPO_L)
HPO_R: EC1.1 U31.26(HPO_R)
I2C1_SCL: R96.2
I2C1_SCL_AUDIO: R96.1 U31.38(SCL)
I2C1_SDA: R97.2
I2C1_SDA_AUDIO: R97.1 U31.39(SDA)
I2S1_LRCK_RX: R86.1
I2S1_LRCK_TX: R85.1
I2S1_SCLK: R84.1
I2S1_SDI0: R88.1
I2S1_SDO0: R87.1
I2S_CLK: R83.1
LDO1_EN: R89.1 R90.1 U31.44(LDO1_EN)
LINE_IN_DET: ED62.1(A1) J103.LS J103.RS R80.2
LINE_IN_L: C102.1 ED29.1(A1) J103.L R286.1
LINE_IN_R: C103.1 ED30.1(A1) J103.R R285.1
LINE_OUT_L: R116.1 U31.16(LOUTL)
LINE_OUT_R: R115.1 U31.17(LOUTR)
LOUT: ED24.1(A1) J16.L R105.1
MIC_IN1N: C124.1 C143.2 C145.1 ED23.1(A1) J14.1 R107.1 R296.2
MIC_IN1P: C123.1 C143.1 C144.1 ED20.1(A1) J14.2 R100.2 R295.2
MIC_IN2P: C32.2 ED22.1(A1) J16.COM2 R99.1
ROUT: ED21.1(A1) J16.R R104.1
SPK_LN: C149.2 ED26.1(A1) FB3.2 J17.2
SPK_LN1: FB3.1 U31.48(SPO_LN)
SPK_LP: C148.1 ED25.1(A1) FB2.2 J17.1
SPK_LP1: FB2.1 U31.1(SPO_LP)
SPK_RN: C156.2 ED32.1(A1) FB5.2 J17.4
SPK_RN1: FB5.1 U31.47(SPO_RN)
SPK_RP: C153.1 ED31.1(A1) FB4.2 J17.3
SPK_RP1: FB4.1 U31.45(SPO_RP)
NetC32_1: C32.1 U31.13(MONOP)
NetC101_1: C101.1 U31.14(MONON)
NetC102_2: C102.2 U31.7(IN2P)
NetC103_2: C103.2 U31.8(IN2N/JD2)
NetC120_1: C120.1 U31.20(CPP1)
NetC120_2: C120.2 U31.21(CPN1)
NetC121_1: C121.1 U31.24(CPVPP)
NetC122_1: C122.1 U31.27(CPVEE)
NetC123_2: C123.2 U31.5(IN1P/DMIC1_DAT)
NetC124_2: C124.2 U31.6(IN1N/DMIC2_DAT/JD1)
NetC125_1: C125.1 U31.19(CPP2)
NetC125_2: C125.2 U31.18(CPN2)
NetC132_2: C132.2 U31.11(VREF1)
NetC133_2: C133.2 U31.12(VREF2)
NetC140_1: C140.1 R98.1 R99.2
NetC141_1: C141.1 C142.1 R100.1 R101.1
NetC147_2: C147.2 Q6.3(G) Q7.3(G) R111.1
NetEC1_2: EC1.2 Q6.1(D) R102.2
NetEC2_2: EC2.2 Q7.1(D) R103.2
NetED27_1: ED27.1(A1) J44.1 R115.2
NetED28_1: ED28.1(A1) J44.3 R116.2
NetQ6_2: Q6.2(S) R102.1 R104.2 R110.2
NetQ7_2: Q7.2(S) R103.1 R105.2 R109.2
NetR83_2: R83.2 U31.37(MCLK)
NetR84_2: R84.2 U31.36(BCLK1)
NetR85_2: R85.2 R86.2 U31.35(LRCLK1)
NetR87_2: R87.2 U31.33(DACDAT1)
NetR88_2: R88.2 U31.34(ADCDAT1)
NetR92_2: R92.2 U31.30(BLCK2)
NetR93_2: R93.2 U31.29(LRCLK2)
NetR94_2: R94.2 U31.31(DACDAT2)
NetR95_2: R95.2 U31.32(ADCDAT2)
NetR295_1: R295.1 ; port AROUT
NetR296_1: R296.1 ; port ALOUT

Not connected (* = marked no-connect by the designer): J16 LS*; J103 COM2*; U31 40(GIPO/IRQ)* 41(DMIC_SCL)*

### Notes on the sheet
- CODEC
- MIC0
- EARPHONE
- LINEIN
- SPEAKER
- LINE_OUT
- [page 12 of 21 - PDF]
  - Create:  SOT.SchLib
  - No footprint: U31
- (in symbol 1SMB54CAT3) E0402
- (in symbol Header2) con-2pin-2d0
- (in symbol L1) BLM18EG601SN1; 0R

### Library data of the parts
C32 C101-C103 C116-C125 C127 C129-C149 C153 C156 = Cap: Capacitor; Published: 8-Jun-2000; LatestRevisionDate: 17-Jul-2002; LatestRevisionNote: Re-released for DXP Platform.; PackageReference: RAD-0.3; Publisher: Altium Limited; PackageDescription: Radial Cap, Thru-Hole; 2 Leads; 0.3 in Pin Spacing
EC1 EC2 = CN-ALU-SMD: Polarized Capacitor (Axial); Published: 8-Jun-2000; LatestRevisionDate: 17-Jul-2002; LatestRevisionNote: Re-released for DXP Platform.; PackageReference: POLAR0.8; Publisher: Altium Limited
ED19-ED32 ED62 = 1SMB54CAT3: as ED13-ED16 on sheet HOST_PORT-USB2.0; DatasheetVersion: Rev. A; PackageVersion: Rev. A, 01/2000; PackageReference: SMB-2-403C-01; PackageDescription: 2-Pin Small Molded Package, J-Bend Lead, Body 4.315 x 3.555 mm; Supplier 1: Digi-Key; Supplier Part Number 1: 1SMB54CAT3-ND; Direction: Bidirectional; Packing: Tape and Reel; Mounting Technology: Surface Mount; PartNumber: 1SMB54CAT3; ComponentLink1Description: Manufacturer URL; ComponentLink1URL: http://www.onsemi.com/; ComponentLink2Description: Datasheet; ComponentLink2URL: http://www.onsemi.com/pub_link/Collateral/1SMB10CAT3-D.PDF; ComponentLink3Description: Package Specification; ComponentLink3URL: http://www.onsemi.com/pub_link/Collateral/1SMB10CAT3-D.PDF
FB1-FB5 = L1: Inductor; Value: 150 mH
J14 = Header2: Header IDC, 2 x 1 Pin Vertical 2.54mm Pitch (Non-Boxed, Male); Manufacturer: W¨¹rth Elektronik eiSos GmbH; partNo: 613002143121; ComponentLink1 Description: Manufacturer; ComponentLink2 Description: Datasheet; NoPins: 02; Created Date: 29 March 2013; ComponentLink1URL: http://www.we-online.com; ComponentLink2URL: http://katalog.we-online.de/em/datasheet/6130xx143121.pdf; Created by: Karrer Zheng
J16 J103 = ST-PJ-312: SMD Audio Jack; 3.5mm; MF: Suntech; SnapEDA_Link: https://www.snapeda.com/parts/ST-PJ-312/Suntech/view-part/?ref=snap; Availability: Unavailable; Price: None; Package: None; MP: ST-PJ-312; Value: *
J17 = Header 4: Header, 4-Pin; LatestRevisionDate: 17-Jul-2002; LatestRevisionNote: Re-released for DXP Platform.; Publisher: Altium Limited
J44 = Header3: Header IDC, 3 x 1 Pin Vertical 2.54mm Pitch (Non-Boxed, Male); Manufacturer: W¨¹rth Elektronik eiSos GmbH; partNo: 613002143121; ComponentLink1 Description: Manufacturer; ComponentLink2 Description: Datasheet; NoPins: 02; Created Date: 29 March 2013; ComponentLink1URL: http://www.we-online.com; ComponentLink2URL: http://katalog.we-online.de/em/datasheet/6130xx143121.pdf; Created by: Karrer Zheng
Q6 Q7 = ZXM61N02F: 20V N-Channel Enhancement Mode MOSFET; Published: 17-Dec-2003; DatasheetVersion: May-99; PackageVersion: 1996; PackageReference: SOT23; Publisher: Altium Limited; PackageDescription: SOT-23; 3 Leads; Body 3.1 x 2.5 mm, inc. leads (LxW max), Alternate Lead Configuration; ComponentLink1Description: Manufacturer Link; ComponentLink1URL: http://www.zetex.com/; ComponentLink2Description: Datasheet; ComponentLink2URL: www.zetex.com/3.0/pdf/ZXM61N02F.pdf
R80 R83-R112 R115 R116 R285 R286 R295 R296 = Res-SMD: as R47-R56 on sheet HOST_PORT-USB2.0; Published: 08/06/2000; Publisher: Altium Hobart Technology Centre